# EAGLE design InkTime (EAGLE 9.7.0)

## Sheet 1 of 2
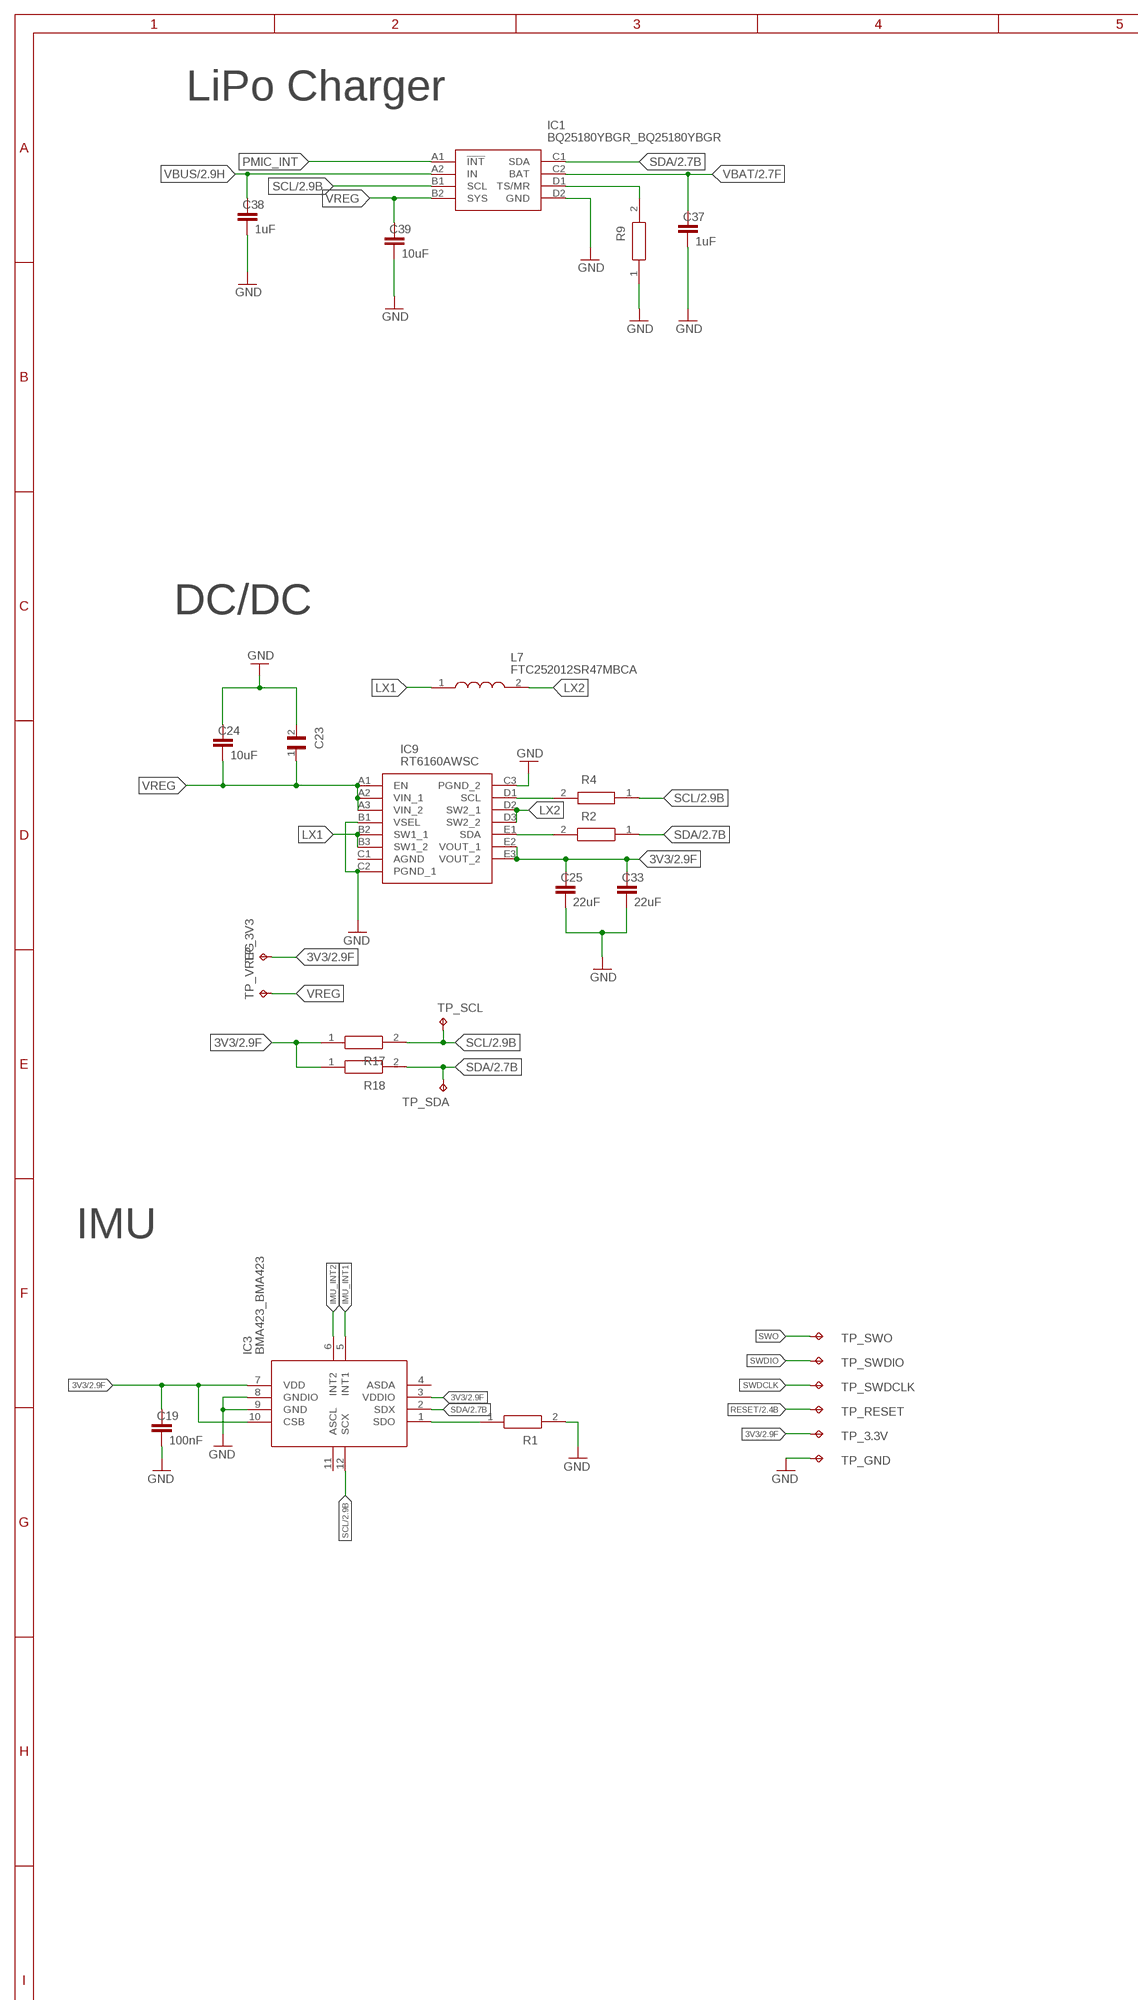
[diagram p0: schematic, sheet 1, part 1 of 2]
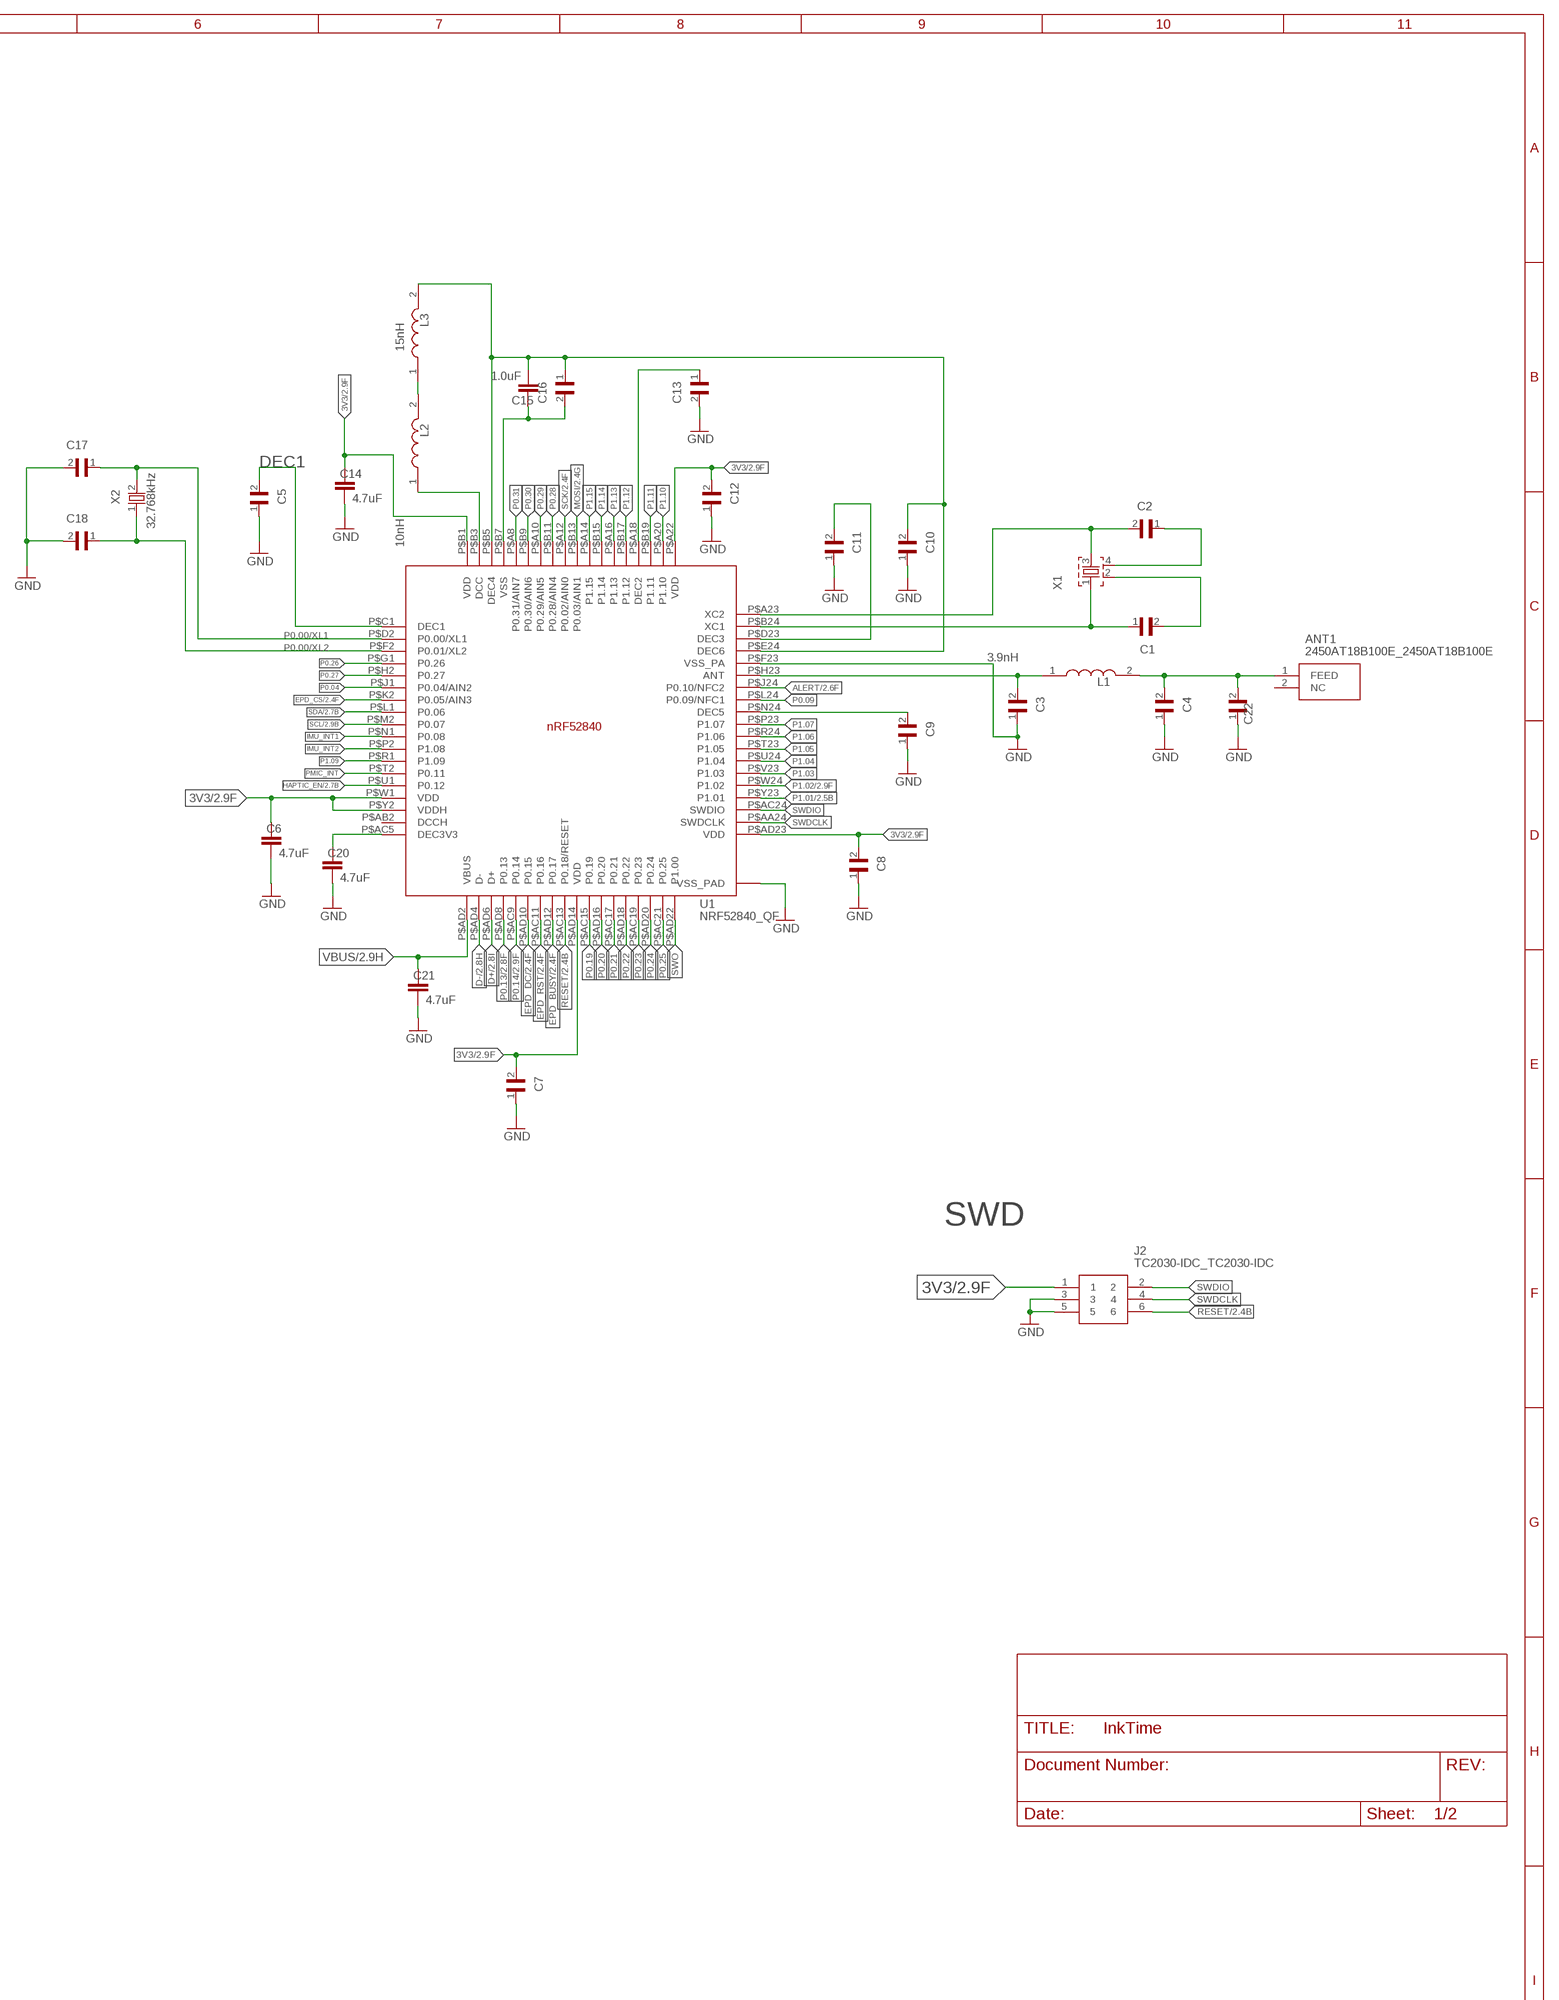
[diagram p1: schematic, sheet 1, part 2 of 2]

### Parts
ANT1  2450AT18B100E_2450AT18B100E  [2450AT18B100E_ANTC3216X140N]
C1  12pF  GRM011R60J152KE01L_2_GRM011R60J152KE01L  [GRM011R60J152KE01L_2_CAPC0201X13N]
C2  12pF  GRM011R60J152KE01L_2_GRM011R60J152KE01L  [GRM011R60J152KE01L_2_CAPC0201X13N]
C3  1pF  GRM011R60J152KE01L_2_GRM011R60J152KE01L  [GRM011R60J152KE01L_2_CAPC0201X13N]
C4  1pF  GRM011R60J152KE01L_2_GRM011R60J152KE01L  [GRM011R60J152KE01L_2_CAPC0201X13N]
C5  100nF  GRM011R60J152KE01L_2_GRM011R60J152KE01L  [GRM011R60J152KE01L_2_CAPC0201X13N]
C6  4.7uF  NORDIC_NRF_3_CAPACITOR_0402_N  [NORDIC_NRF_3_RESC0402_N]
C7  100nF  GRM011R60J152KE01L_2_GRM011R60J152KE01L  [GRM011R60J152KE01L_2_CAPC0201X13N]
C8  100nF  GRM011R60J152KE01L_2_GRM011R60J152KE01L  [GRM011R60J152KE01L_2_CAPC0201X13N]
C9  820pF  GRM011R60J152KE01L_2_GRM011R60J152KE01L  [GRM011R60J152KE01L_2_CAPC0201X13N]
C10  N.C.  GRM011R60J152KE01L_2_GRM011R60J152KE01L  [GRM011R60J152KE01L_2_CAPC0201X13N]
C11  100pF  GRM011R60J152KE01L_2_GRM011R60J152KE01L  [GRM011R60J152KE01L_2_CAPC0201X13N]
C12  100nF  GRM011R60J152KE01L_2_GRM011R60J152KE01L  [GRM011R60J152KE01L_2_CAPC0201X13N]
C13  N.C.  GRM011R60J152KE01L_2_GRM011R60J152KE01L  [GRM011R60J152KE01L_2_CAPC0201X13N]
C14  4.7uF  NORDIC_NRF_3_CAPACITOR_0402_N  [NORDIC_NRF_3_RESC0402_N]
C15  1.0uF  NORDIC_NRF_3_CAPACITOR_0402_N  [NORDIC_NRF_3_RESC0402_N]
C16  47nF  GRM011R60J152KE01L_2_GRM011R60J152KE01L  [GRM011R60J152KE01L_2_CAPC0201X13N]
C17  12pF  GRM011R60J152KE01L_2_GRM011R60J152KE01L  [GRM011R60J152KE01L_2_CAPC0201X13N]
C18  12pF  GRM011R60J152KE01L_2_GRM011R60J152KE01L  [GRM011R60J152KE01L_2_CAPC0201X13N]
C19  100nF  NORDIC_NRF_3_CAPACITOR_0402_N  [NORDIC_NRF_3_RESC0402_N]
C20  4.7uF  NORDIC_NRF_3_CAPACITOR_0402_N  [NORDIC_NRF_3_RESC0402_N]
C21  4.7uF  NORDIC_NRF_3_CAPACITOR_0402_N  [NORDIC_NRF_3_RESC0402_N]
C22  N.C.  GRM011R60J152KE01L_2_GRM011R60J152KE01L  [GRM011R60J152KE01L_2_CAPC0201X13N]
C23  0.1uF  GRM011R60J152KE01L_2_GRM011R60J152KE01L  [GRM011R60J152KE01L_2_CAPC0201X13N]
C24  10uF  NORDIC_NRF_3_CAPACITOR_0402_N  [NORDIC_NRF_3_RESC0402_N]
C25  22uF  NORDIC_NRF_3_CAPACITOR_0402_N  [NORDIC_NRF_3_RESC0402_N]
C33  22uF  NORDIC_NRF_3_CAPACITOR_0402_N  [NORDIC_NRF_3_RESC0402_N]
C37  1uF  NORDIC_NRF_3_CAPACITOR_0402_N  [NORDIC_NRF_3_RESC0402_N]
C38  1uF  NORDIC_NRF_3_CAPACITOR_0402_N  [NORDIC_NRF_3_RESC0402_N]
C39  10uF  NORDIC_NRF_3_CAPACITOR_0402_N  [NORDIC_NRF_3_RESC0402_N]
IC1  BQ25180YBGR_BQ25180YBGR  [BQ25180YBGR_BGA8C40P2X4_100X155X50]
IC3  BMA423_BMA423  [BMA423_BMA423]
IC9  RT6160AWSC  RT6160AWSC_RT6160AWSC  [RT6160AWSC_BGA15C40P3X5_140X230X60]
J2  TC2030-IDC_TC2030-IDC  [TC2030-IDC_TC2030IDC]
L1  3.9nH  MLP2016SR47MT0S1_FTC252012SR47MBCA  [MLP2016SR47MT0S1_INDC2016X100N]
L2  10nH  MLP2016SR47MT0S1_FTC252012SR47MBCA  [MLP2016SR47MT0S1_INDC2016X100N]
L3  15nH  MLP2016SR47MT0S1_FTC252012SR47MBCA  [MLP2016SR47MT0S1_INDC2016X100N]
L7  FTC252012SR47MBCA  MLP2016SR47MT0S1_FTC252012SR47MBCA  [MLP2016SR47MT0S1_INDC2016X100N]
R1  0  ERA-1AEB3401C_CPF0201D7K68C1  [ERA-1AEB3401C_0201]
R2  0  ERA-1AEB3401C_CPF0201D7K68C1  [ERA-1AEB3401C_0201]
R4  0  ERA-1AEB3401C_CPF0201D7K68C1  [ERA-1AEB3401C_0201]
R9  10k  ERA-1AEB3401C_CPF0201D7K68C1  [ERA-1AEB3401C_0201]
R17  3k3  ERA-1AEB3401C_CPF0201D7K68C1  [ERA-1AEB3401C_0201]
R18  3K3  ERA-1AEB3401C_CPF0201D7K68C1  [ERA-1AEB3401C_0201]
TP_3.3V  HECTOR_WATCH_1_TPTP20R  [HECTOR_WATCH_1_TP20R]
TP_3V3  HECTOR_WATCH_1_TPTP20R  [HECTOR_WATCH_1_TP20R]
TP_GND  HECTOR_WATCH_1_TPTP20R  [HECTOR_WATCH_1_TP20R]
TP_RESET  HECTOR_WATCH_1_TPTP20R  [HECTOR_WATCH_1_TP20R]
TP_SCL  HECTOR_WATCH_1_TPTP20R  [HECTOR_WATCH_1_TP20R]
TP_SDA  HECTOR_WATCH_1_TPTP20R  [HECTOR_WATCH_1_TP20R]
TP_SWDCLK  HECTOR_WATCH_1_TPTP20R  [HECTOR_WATCH_1_TP20R]
TP_SWDIO  HECTOR_WATCH_1_TPTP20R  [HECTOR_WATCH_1_TP20R]
TP_SWO  HECTOR_WATCH_1_TPTP20R  [HECTOR_WATCH_1_TP20R]
TP_VREG  HECTOR_WATCH_1_TPTP20R  [HECTOR_WATCH_1_TP20R]
U1  NRF52840_QF  NORDIC_NRF_4_NRF52840_QF  [NORDIC_NRF_4_AQFN50P700X700X85_HS-74N]
X1  NORDIC_NRF_XTAL_32MHZ  [NORDIC_NRF_BT-XTAL_2016_N]
X2  32.768kHz  NORDIC_NRF_1_XTAL_32KHZ  [NORDIC_NRF_1_XTAL_3215_N]

### Nets
3V3 [Power]: C6.1 C7.2 C8.2 C12.2 C14.1 C19.1 C25.1 C33.1 IC3.3(VDDIO) IC3.7(VDD) IC3.10(CSB) IC9.E2(VOUT_1) IC9.E3(VOUT_2) J2.1 R17.1 R18.1 TP_3.3V.TP TP_3V3.TP U1.P$A22(VDD) U1.P$AD14(VDD) U1.P$AD23(VDD) U1.P$B1(VDD) U1.P$W1(VDD) U1.P$Y2(VDDH) ; also sheet 2
ALERT: U1.P$J24(P0.10/NFC2) ; also sheet 2
D+: U1.P$AD6(D+) ; also sheet 2
D-: U1.P$AD4(D-) ; also sheet 2
DEC1: C5.2 U1.P$C1(DEC1)
EPD_BUSY: U1.P$AD12(P0.17) ; also sheet 2
EPD_CS: U1.P$K2(P0.05/AIN3) ; also sheet 2
EPD_DC: U1.P$AD10(P0.15) ; also sheet 2
EPD_RST: U1.P$AC11(P0.16) ; also sheet 2
GND: C3.1 C4.1 C5.1 C6.2 C7.1 C8.1 C9.1 C10.1 C11.1 C12.1 C13.2 C14.2 C17.2 C18.2 C19.2 C20.2 C21.2 C22.1 C23.2 C24.1 C25.2 C33.2 C37.2 C38.2 C39.2 IC1.D2(GND) IC3.8(GNDIO) IC3.9(GND) IC9.B1(VSEL) IC9.C2(PGND_1) IC9.C3(PGND_2) J2.3 J2.5 R1.2 R9.1 TP_GND.TP U1.P$74(VSS_PAD) U1.P$75(VSS_PAD) U1.P$76(VSS_PAD) U1.P$77(VSS_PAD) U1.P$78(VSS_PAD) U1.P$79(VSS_PAD) U1.P$80(VSS_PAD) U1.P$81(VSS_PAD) U1.P$82(VSS_PAD) U1.P$83(VSS_PAD) U1.P$84(VSS_PAD) U1.P$85(VSS_PAD) U1.P$86(VSS_PAD) U1.P$87(VSS_PAD) U1.P$88(VSS_PAD) U1.P$89(VSS_PAD) U1.P$90(VSS_PAD) U1.P$F23(VSS_PA) ; supply symbol labelled SUPPLY1_GND ; also sheet 2
HAPTIC_EN: U1.P$U1(P0.12) ; also sheet 2
IMU_INT1: IC3.5(INT1) U1.P$N1(P0.08)
IMU_INT2: IC3.6(INT2) U1.P$P2(P1.08)
LX1: IC9.B2(SW1_1) IC9.B3(SW1_2) L7.1
LX2: IC9.D2(SW2_1) IC9.D3(SW2_2) L7.2
MOSI: U1.P$B13(P0.03/AIN1) ; also sheet 2
N$2: C20.1 U1.P$AC5(DEC3V3)
N$3: IC1.D1(TS/MR) R9.2
N$4: C9.2 U1.P$N24(DEC5)
N$5: C3.2 L1.1 U1.P$H23(ANT)
N$6: IC9.D1(SCL) R4.2
N$7: ANT1.1(FEED) C4.2 C22.2 L1.2
N$8: IC9.E1(SDA) R2.2
N$9: C10.2 C15.2 C16.1 L3.2 U1.P$B5(DEC4) U1.P$E24(DEC6)
N$10: IC3.1(SDO) R1.1
N$11: C11.2 U1.P$D23(DEC3)
N$12: C2.2 U1.P$A23(XC2) X1.3
N$13: C2.1 X1.4
N$14: C1.2 X1.2
N$15: C1.1 U1.P$B24(XC1) X1.1
N$16: L2.2 L3.1
N$19: C13.1 U1.P$A18(DEC2)
N$30: C15.1 C16.2 U1.P$B7(VSS)
N$32: L2.1 U1.P$B3(DCC)
P0.00/XL1: C17.1 U1.P$D2(P0.00/XL1) X2.2
P0.00/XL2: C18.1 U1.P$F2(P0.01/XL2) X2.1
P0.04: U1.P$J1(P0.04/AIN2)
P0.09: U1.P$L24(P0.09/NFC1)
P0.13: U1.P$AD8(P0.13) ; also sheet 2
P0.14: U1.P$AC9(P0.14) ; also sheet 2
P0.19: U1.P$AC15(P0.19)
P0.20: U1.P$AD16(P0.20)
P0.21: U1.P$AC17(P0.21)
P0.22: U1.P$AD18(P0.22)
P0.23: U1.P$AC19(P0.23)
P0.24: U1.P$AD20(P0.24)
P0.25: U1.P$AC21(P0.25)
P0.26: U1.P$G1(P0.26)
P0.27: U1.P$H2(P0.27)
P0.28: U1.P$B11(P0.28/AIN4)
P0.29: U1.P$A10(P0.29/AIN5)
P0.30: U1.P$B9(P0.30/AIN6)
P0.31: U1.P$A8(P0.31/AIN7)
P1.01: U1.P$Y23(P1.01) ; also sheet 2
P1.02: U1.P$W24(P1.02) ; also sheet 2
P1.03: U1.P$V23(P1.03)
P1.04: U1.P$U24(P1.04)
P1.05: U1.P$T23(P1.05)
P1.06: U1.P$R24(P1.06)
P1.07: U1.P$P23(P1.07)
P1.09: U1.P$R1(P1.09)
P1.10: U1.P$A20(P1.10)
P1.11: U1.P$B19(P1.11)
P1.12: U1.P$B17(P1.12)
P1.13: U1.P$A16(P1.13)
P1.14: U1.P$B15(P1.14)
P1.15: U1.P$A14(P1.15)
PMIC_INT: IC1.A1(!INT) U1.P$T2(P0.11)
RESET: J2.6 TP_RESET.TP U1.P$AC13(P0.18/RESET) ; also sheet 2
SCK: U1.P$A12(P0.02/AIN0) ; also sheet 2
SCL: IC1.B1(SCL) IC3.12(SCX) R4.1 R17.2 TP_SCL.TP U1.P$M2(P0.07) ; also sheet 2
SDA: IC1.C1(SDA) IC3.2(SDX) R2.1 R18.2 TP_SDA.TP U1.P$L1(P0.06) ; also sheet 2
SWDCLK: J2.4 TP_SWDCLK.TP U1.P$AA24(SWDCLK)
SWDIO: J2.2 TP_SWDIO.TP U1.P$AC24(SWDIO)
SWO: TP_SWO.TP U1.P$AD22(P1.00)
VBAT [Power]: C37.1 IC1.C2(BAT) ; also sheet 2
VBUS: C21.1 C38.1 IC1.A2(IN) U1.P$AD2(VBUS) ; also sheet 2
VREG [Power]: C23.1 C24.2 C39.1 IC1.B2(SYS) IC9.A1(EN) IC9.A2(VIN_1) IC9.A3(VIN_2) TP_VREG.TP
Unconnected: ANT1.2(NC) IC3.4(ASDA) IC3.11(ASCL) IC9.C1(AGND) U1.P$AB2(DCCH)

### Notes on the sheet
- LiPo Charger
- DC/DC
- SWD
- IMU

## Sheet 2 of 2
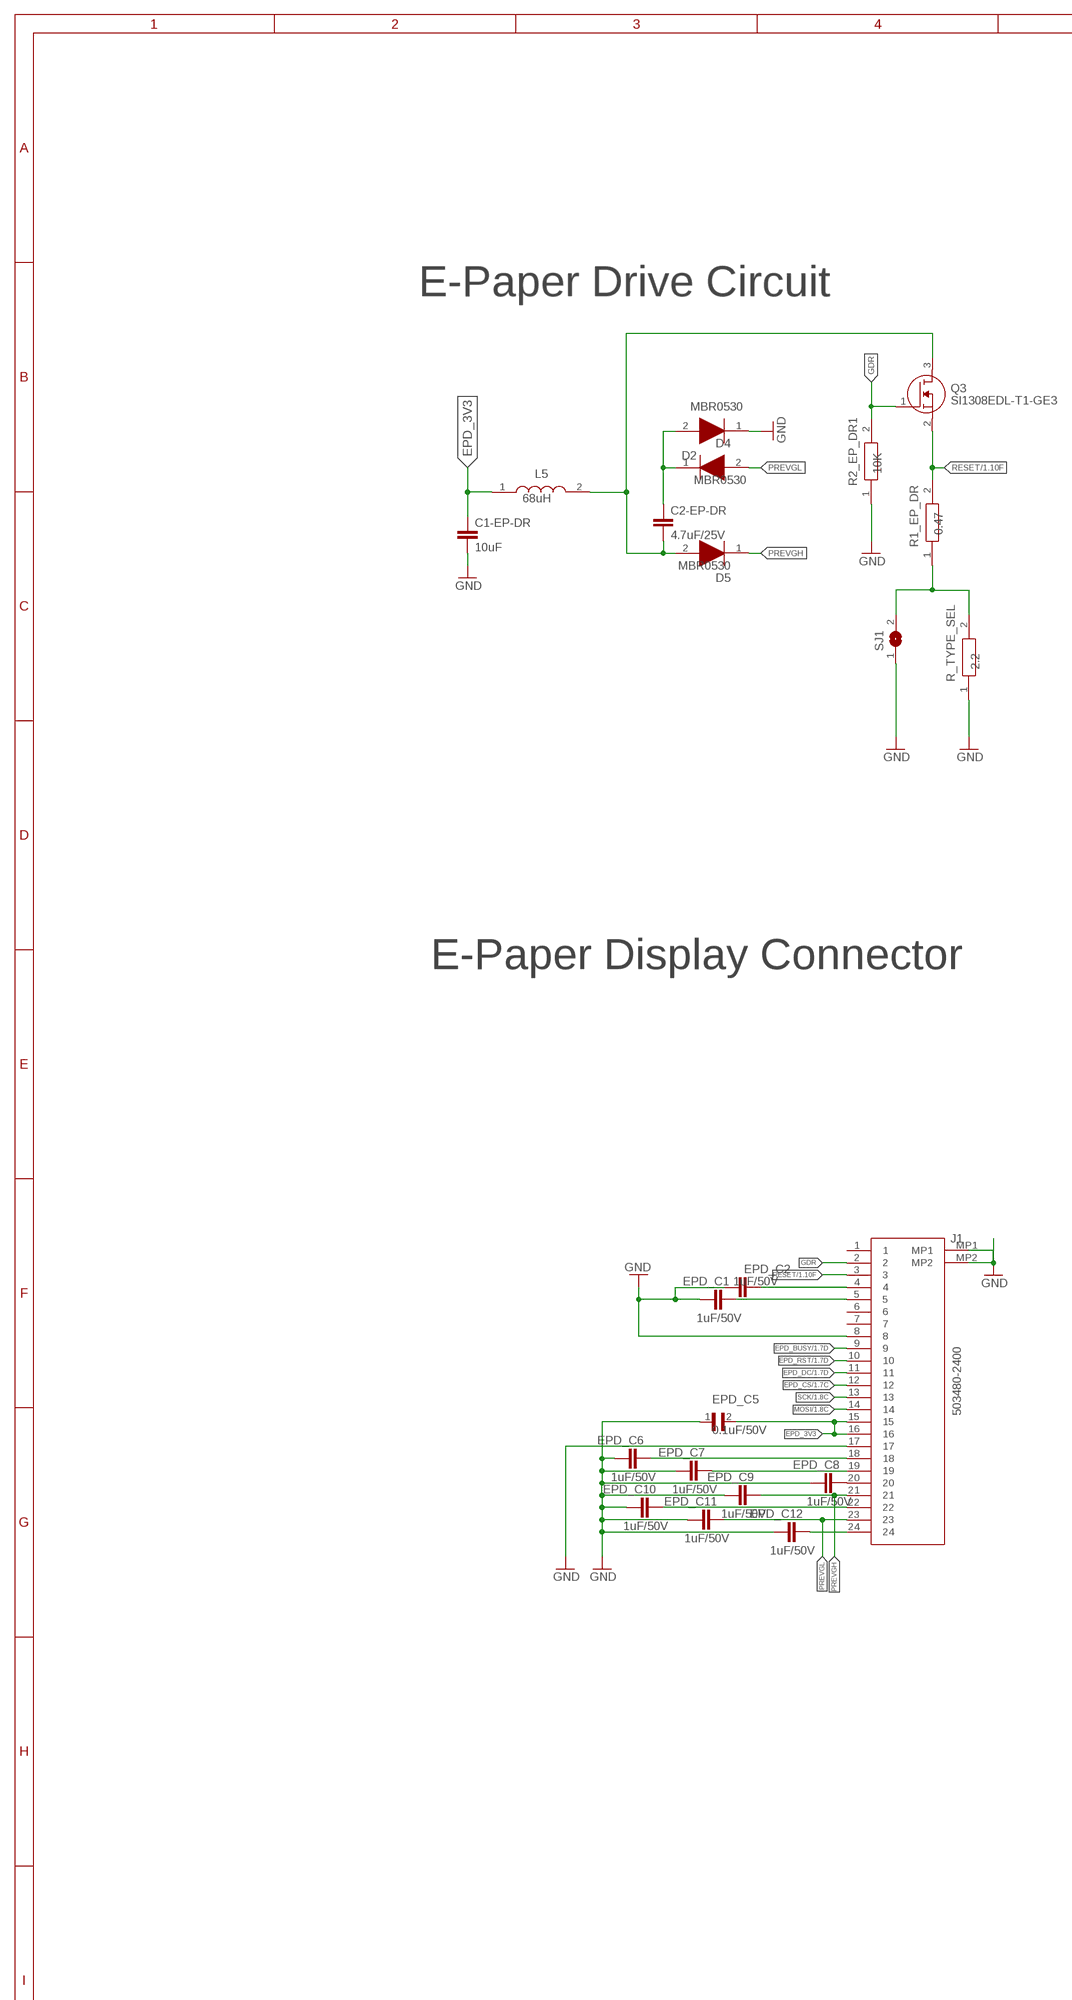
[diagram p2: schematic, sheet 2, part 1 of 2]
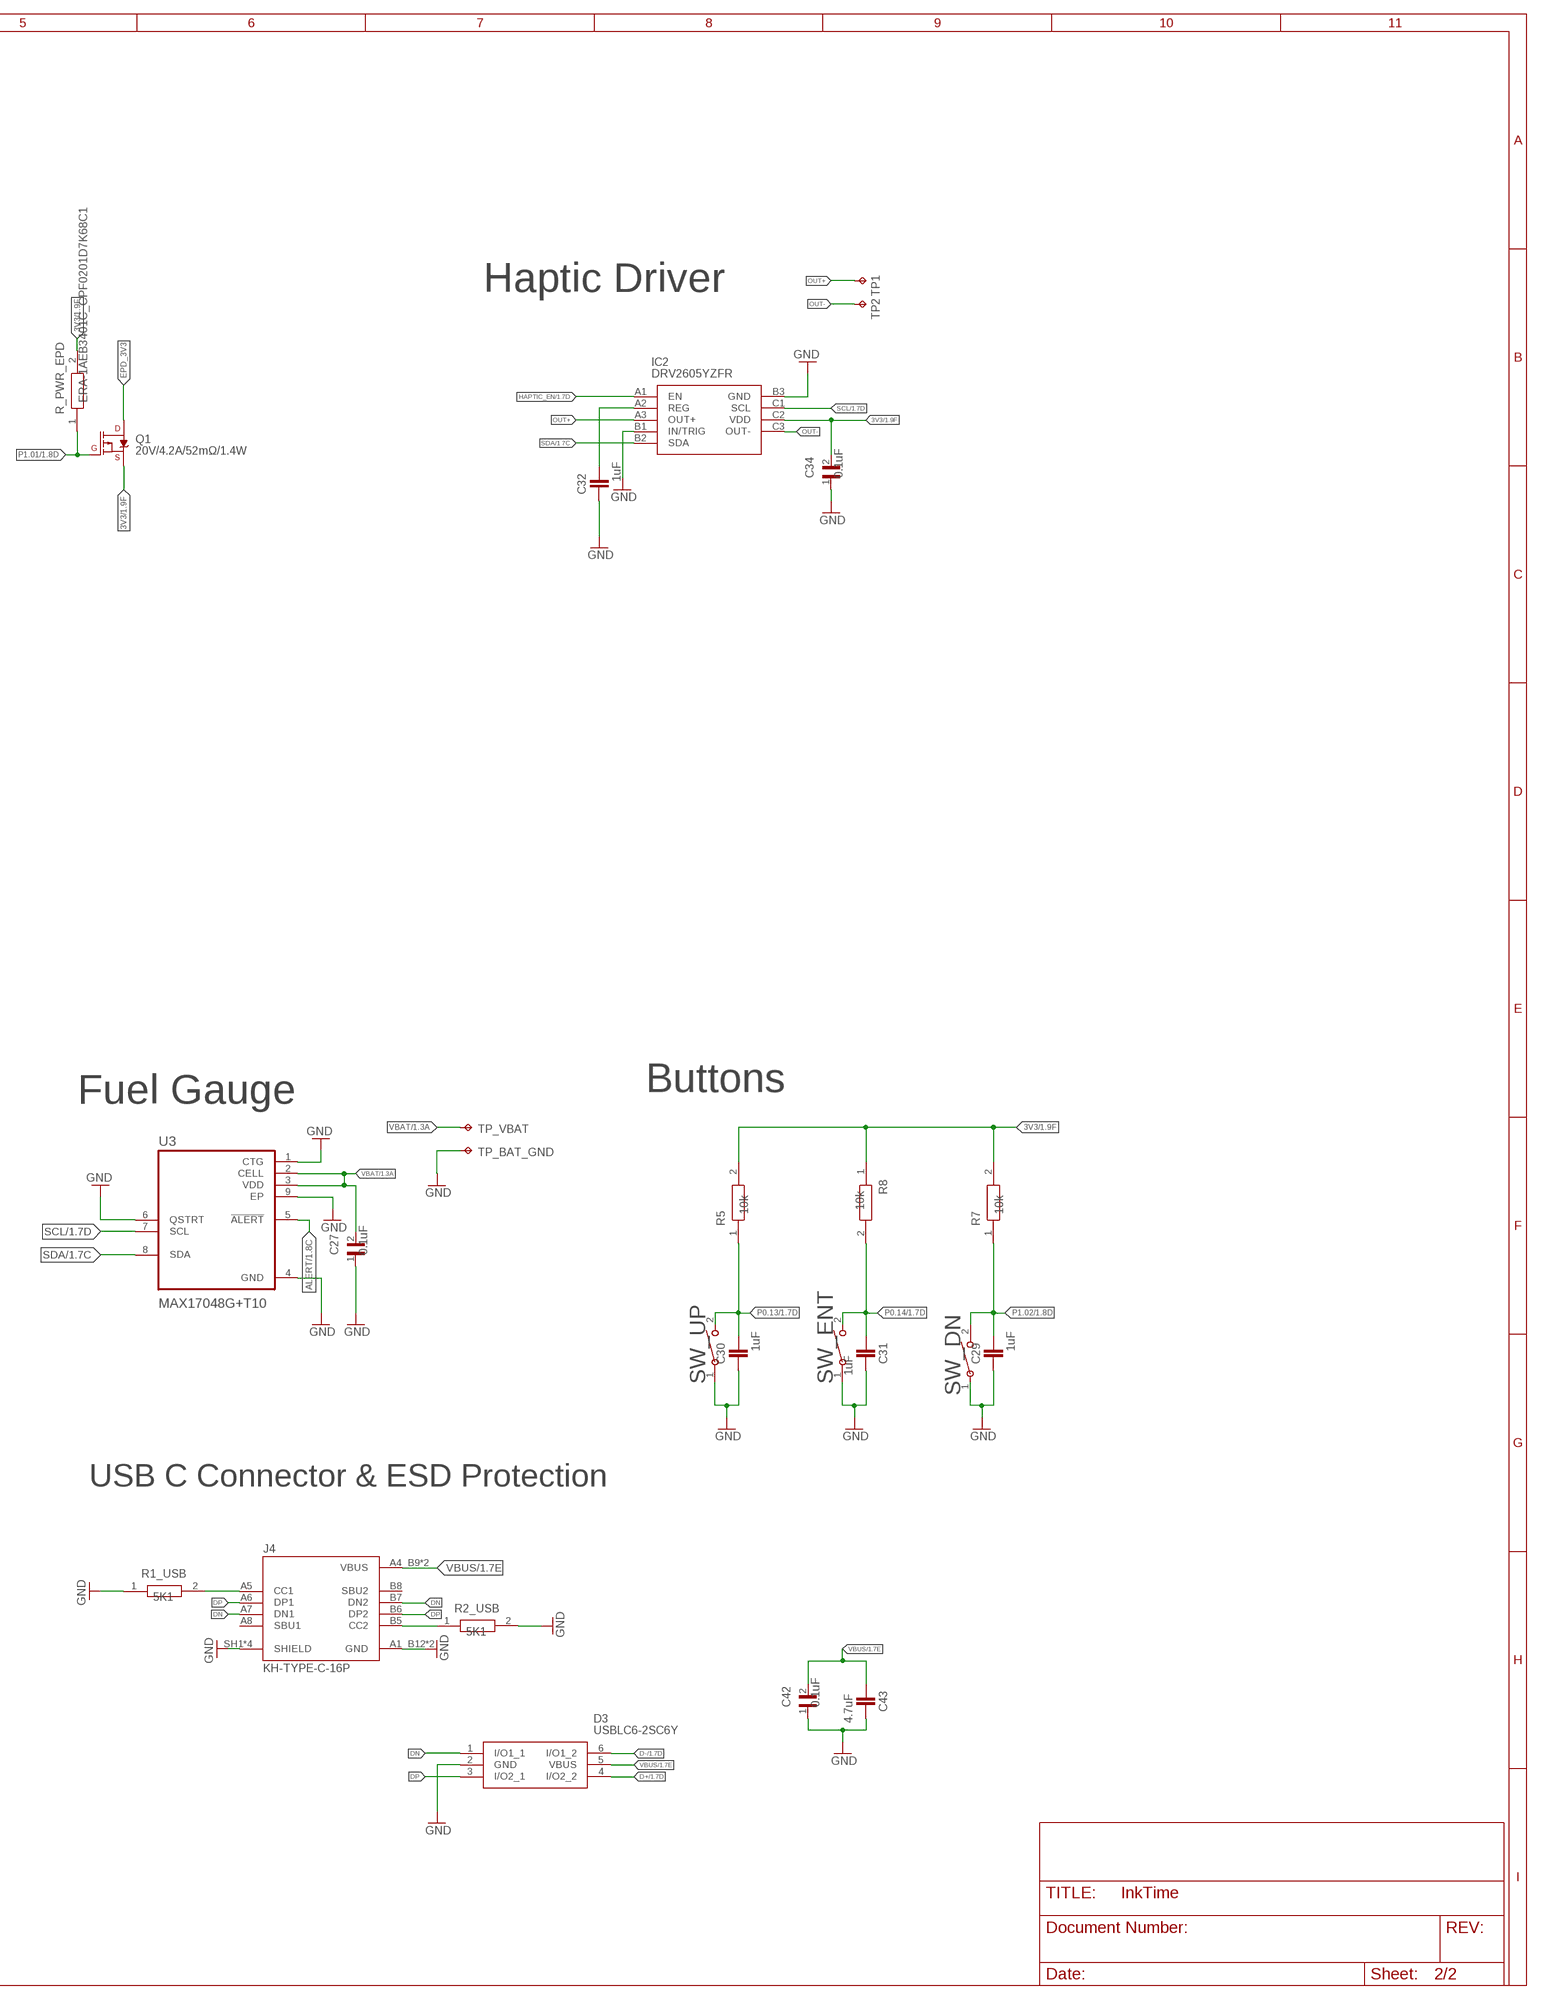
[diagram p3: schematic, sheet 2, part 2 of 2]

### Parts
C1-EP-DR  10uF  NORDIC_NRF_3_CAPACITOR_0402_N  [NORDIC_NRF_3_RESC0402_N]
C2-EP-DR  4.7uF/25V  NORDIC_NRF_3_CAPACITOR_0402_N  [NORDIC_NRF_3_RESC0402_N]
C27  0.1uF  GRM011R60J152KE01L_2_GRM011R60J152KE01L  [GRM011R60J152KE01L_2_CAPC0201X13N]
C29  1uF  NORDIC_NRF_3_CAPACITOR_0402_N  [NORDIC_NRF_3_RESC0402_N]
C30  1uF  NORDIC_NRF_3_CAPACITOR_0402_N  [NORDIC_NRF_3_RESC0402_N]
C31  1uF  NORDIC_NRF_3_CAPACITOR_0402_N  [NORDIC_NRF_3_RESC0402_N]
C32  1uF  NORDIC_NRF_3_CAPACITOR_0402_N  [NORDIC_NRF_3_RESC0402_N]
C34  0.1uF  GRM011R60J152KE01L_2_GRM011R60J152KE01L  [GRM011R60J152KE01L_2_CAPC0201X13N]
C42  0.1uF  GRM011R60J152KE01L_2_GRM011R60J152KE01L  [GRM011R60J152KE01L_2_CAPC0201X13N]
C43  4.7uF  NORDIC_NRF_3_CAPACITOR_0402_N  [NORDIC_NRF_3_RESC0402_N]
D2  MBR0530  ESP32_C6_LIBRARY_5_MBR0530  [ESP32_C6_LIBRARY_5_SOD3716X135N]
D3  USBLC6-2SC6Y  ESP32_C6_LIBRARY_3_USBLC6-2SC6Y  [ESP32_C6_LIBRARY_3_SOT95P280X145-6N]
D4  MBR0530  ESP32_C6_LIBRARY_5_MBR0530  [ESP32_C6_LIBRARY_5_SOD3716X135N]
D5  MBR0530  ESP32_C6_LIBRARY_5_MBR0530  [ESP32_C6_LIBRARY_5_SOD3716X135N]
EPD_C1  1uF/50V  NORDIC_NRF_3_CAPACITOR_0402_N  [NORDIC_NRF_3_RESC0402_N]
EPD_C2  1uF/50V  NORDIC_NRF_3_CAPACITOR_0402_N  [NORDIC_NRF_3_RESC0402_N]
EPD_C5  0.1uF/50V  GRM011R60J152KE01L_2_GRM011R60J152KE01L  [GRM011R60J152KE01L_2_CAPC0201X13N]
EPD_C6  1uF/50V  NORDIC_NRF_3_CAPACITOR_0402_N  [NORDIC_NRF_3_RESC0402_N]
EPD_C7  1uF/50V  NORDIC_NRF_3_CAPACITOR_0402_N  [NORDIC_NRF_3_RESC0402_N]
EPD_C8  1uF/50V  NORDIC_NRF_3_CAPACITOR_0402_N  [NORDIC_NRF_3_RESC0402_N]
EPD_C9  1uF/50V  NORDIC_NRF_3_CAPACITOR_0402_N  [NORDIC_NRF_3_RESC0402_N]
EPD_C10  1uF/50V  NORDIC_NRF_3_CAPACITOR_0402_N  [NORDIC_NRF_3_RESC0402_N]
EPD_C11  1uF/50V  NORDIC_NRF_3_CAPACITOR_0402_N  [NORDIC_NRF_3_RESC0402_N]
EPD_C12  1uF/50V  NORDIC_NRF_3_CAPACITOR_0402_N  [NORDIC_NRF_3_RESC0402_N]
IC2  DRV2605YZFR  DRV2605YZFR_DRV2605YZFR  [DRV2605YZFR_BGA9C50P3X3_144X144X62]
J1  503480-2400  503480-2400_503480-2400  [503480-2400_5034802400]
J4  KH-TYPE-C-16P  KH-TYPE-C-16P_KH-TYPE-C-16P  [KH-TYPE-C-16P_KINGHELM_KH-TYPE-C-16P]
L5  68uH  MLP2016SR47MT0S1_FTC252012SR47MBCA  [MLP2016SR47MT0S1_INDC2016X100N]
Q1  20V/4.2A/52mΩ/1.4W  ESP32_C6_LIBRARY_4_ESP32_WROVER_SPARKFUN-DISCRETESEMI_MOSFET_PCH-DMG2305UX-7  [ESP32_C6_LIBRARY_4_ESP32_C6_LIBRARY_4_ESP32_C6_LIBRARY_4_ESP32_C6_LIBRARY_4_ESP32_WROVER_SPARKFUN-DISCRETESEMI_SOT23-3]
Q3  SI1308EDL-T1-GE3  ESP32_C6_LIBRARY_6_SI1308EDL-T1-GE3  [ESP32_C6_LIBRARY_6_SOT65P210X110-3N]
R1_EP_DR  0.47  ERA-1AEB3401C_CPF0201D7K68C1  [ERA-1AEB3401C_0201]
R1_USB  5K1  ERA-1AEB3401C_CPF0201D7K68C1  [ERA-1AEB3401C_0201]
R2_EP_DR1  10K  ERA-1AEB3401C_CPF0201D7K68C1  [ERA-1AEB3401C_0201]
R2_USB  5K1  ERA-1AEB3401C_CPF0201D7K68C1  [ERA-1AEB3401C_0201]
R5  10k  ERA-1AEB3401C_CPF0201D7K68C1  [ERA-1AEB3401C_0201]
R7  10k  ERA-1AEB3401C_CPF0201D7K68C1  [ERA-1AEB3401C_0201]
R8  10k  ERA-1AEB3401C_CPF0201D7K68C1  [ERA-1AEB3401C_0201]
R_PWR_EPD  ERA-1AEB3401C_CPF0201D7K68C1  [ERA-1AEB3401C_0201]
R_TYPE_SEL  2.2  ERA-1AEB3401C_CPF0201D7K68C1  [ERA-1AEB3401C_0201]
SJ1  ESP32_C6_LIBRARY_7_JUMPER_SJ  [ESP32_C6_LIBRARY_7_JUMPER_SJ]
SW_DN  2025-10-22_07-23-44_LIBRARY_EVP-AKE31ASW_EVP-AKE31A_PAN  [2025-10-22_07-23-44_LIBRARY_SW_EVP-AKE31A_PAN]
SW_ENT  2025-10-22_07-23-44_LIBRARY_EVP-AKE31ASW_EVP-AKE31A_PAN  [2025-10-22_07-23-44_LIBRARY_SW_EVP-AKE31A_PAN]
SW_UP  2025-10-22_07-23-44_LIBRARY_EVP-AKE31ASW_EVP-AKE31A_PAN  [2025-10-22_07-23-44_LIBRARY_SW_EVP-AKE31A_PAN]
TP1  HECTOR_WATCH_1_TPTP20R  [HECTOR_WATCH_1_TP20R]
TP2  HECTOR_WATCH_1_TPTP20R  [HECTOR_WATCH_1_TP20R]
TP_BAT_GND  HECTOR_WATCH_1_TPTP20R  [HECTOR_WATCH_1_TP20R]
TP_VBAT  HECTOR_WATCH_1_TPTP20R  [HECTOR_WATCH_1_TP20R]
U3  MAX17048G+T10  ESP32_C6_LIBRARY_MAX17048G+T10  [ESP32_C6_LIBRARY_SON50P200X200X80-9N]

### Nets
3V3 [Power]: C34.2 IC2.C2(VDD) Q1.2(S) R5.2 R7.2 R8.1 R_PWR_EPD.2 ; also sheet 1
ALERT: U3.5(!ALERT) ; also sheet 1
D+: D3.4(I/O2_2) ; also sheet 1
D-: D3.6(I/O1_2) ; also sheet 1
DN: D3.1(I/O1_1) J4.A7(DN1) J4.B7(DN2)
DP: D3.3(I/O2_1) J4.A6(DP1) J4.B6(DP2)
EPD_3V3 [Power]: C1-EP-DR.1 EPD_C5.2 J1.15 J1.16 L5.1 Q1.3(D)
EPD_BUSY: J1.9 ; also sheet 1
EPD_CS: J1.12 ; also sheet 1
EPD_DC: J1.11 ; also sheet 1
EPD_RST: J1.10 ; also sheet 1
GDR: J1.2 Q3.1(G) R2_EP_DR1.2
GND: C1-EP-DR.2 C27.1 C29.1 C30.1 C31.2 C32.1 C34.1 C42.1 C43.2 D3.2(GND) D4.1(K) EPD_C1.1 EPD_C2.1 EPD_C5.1 EPD_C6.1 EPD_C7.1 EPD_C8.1 EPD_C9.1 EPD_C10.1 EPD_C11.1 EPD_C12.1 IC2.B1(IN/TRIG) IC2.B3(GND) J1.8 J1.17 J1.MP1 J1.MP2 J4.A1_B12(GND) J4.A12_B1(GND) J4.SH1(SHIELD) J4.SH2(SHIELD) J4.SH3(SHIELD) J4.SH4(SHIELD) R1_USB.1 R2_EP_DR1.1 R2_USB.2 R_TYPE_SEL.1 SJ1.1 SW_DN.1 SW_ENT.1 SW_UP.1 TP_BAT_GND.TP U3.1(CTG) U3.4(GND) U3.6(QSTRT) U3.9(EP) ; also sheet 1
HAPTIC_EN: IC2.A1(EN) ; also sheet 1
MOSI: J1.14 ; also sheet 1
N$17: C2-EP-DR.2 D5.2(A) L5.2 Q3.3(D)
N$18: C2-EP-DR.1 D2.1(K) D4.2(A)
N$20: R1_EP_DR.1 R_TYPE_SEL.2 SJ1.2
N$21: J4.A5(CC1) R1_USB.2
N$23: EPD_C2.2 J1.4
N$24: EPD_C1.2 J1.5
N$25: EPD_C6.2 J1.18
N$26: EPD_C7.2 J1.19
N$27: EPD_C8.2 J1.20
N$28: C32.2 IC2.A2(REG)
N$29: EPD_C10.2 J1.22
N$33: EPD_C12.2 J1.24
N$38: J4.B5(CC2) R2_USB.1
OUT+: IC2.A3(OUT+) TP1.TP
OUT-: IC2.C3(OUT-) TP2.TP
P0.13: C30.2 R5.1 SW_UP.2 ; also sheet 1
P0.14: C31.1 R8.2 SW_ENT.2 ; also sheet 1
P1.01: Q1.1(G) R_PWR_EPD.1 ; also sheet 1
P1.02: C29.2 R7.1 SW_DN.2 ; also sheet 1
PREVGH: D5.1(K) EPD_C9.2 J1.21
PREVGL: D2.2(A) EPD_C11.2 J1.23
RESET: J1.3 Q3.2(S) R1_EP_DR.2 ; also sheet 1
SCK: J1.13 ; also sheet 1
SCL: IC2.C1(SCL) U3.7(SCL) ; also sheet 1
SDA: IC2.B2(SDA) U3.8(SDA) ; also sheet 1
VBAT [Power]: C27.2 TP_VBAT.TP U3.2(CELL) U3.3(VDD) ; also sheet 1
VBUS: C42.2 C43.1 D3.5(VBUS) J4.A4_B9(VBUS) J4.A9_B4(VBUS) ; also sheet 1
Unconnected: J1.1 J1.6 J1.7 J4.A8(SBU1) J4.B8(SBU2)

### Notes on the sheet
- E-Paper Drive Circuit | Haptic Driver
- E-Paper Display Connector
- Fuel Gauge | Buttons
- USB C Connector & ESD Protection

## Library data of the parts
ANT1 = InkTime_v5:2450AT18B100E_2450AT18B100E: Antennas 2.45GHz ANTENNA Source: Datasheet <https://www.johansontechnology.com/datasheets/2450AT18B100/2450AT18B100.pdf>; ARROW_PART_NUMBER: 2450AT18B100E; ARROW_PRICE-STOCK: https://www.arrow.com/en/products/2450at18b100e/johanson-dielectrics?utm_currency=USD&region=nac; DESCRIPTION: Antennas 2.45GHz ANTENNA; HEIGHT: 1.4mm; MANUFACTURER_NAME: JOHANSON TECHNOLOGY; MANUFACTURER_PART_NUMBER: 2450AT18B100E; MOUSER_PART_NUMBER: 609-2450AT18B100E; MOUSER_PRICE-STOCK: https://www.mouser.co.uk/ProductDetail/Johanson-Technology/2450AT18B100E?qs=yCnrNFeXz%252Bh5MFsFIXGZGA%3D%3D
C1-C5 C7-C13 C16-C18 C22 C23 C27 C34 C42 EPD_C5 = InkTime_v5:GRM011R60J152KE01L_2_GRM011R60J152KE01L: Check availability <https://pricing.snapeda.com/parts/GRM011R60J152KE01L/Murata/view-part?ref=eda>; AVAILABILITY: In Stock; CHECK_PRICES: https://www.snapeda.com/parts/GRM011R60J152KE01L/Murata/view-part/?ref=eda; DESCRIPTION: SMD Capacitor X5R(EIA) with Capacitance: 1500pF Tol. 10%. Rated Voltage: 6.3Vdc; MF: Murata; MP: GRM011R60J152KE01L; PACKAGE: 0201 Murata; PRICE: None; SNAPEDA_LINK: https://www.snapeda.com/parts/GRM011R60J152KE01L/Murata/view-part/?ref=snap
C1-EP-DR C2-EP-DR C6 C14 C15 C19-C21 C24 C25 C29-C33 C37-C39 C43 EPD_C1 EPD_C2 EPD_C6-EPD_C12 = InkTime_v5:NORDIC_NRF_3_CAPACITOR: Generic chip capacitor
D2 D4 D5 = InkTime_v5:ESP32_C6_LIBRARY_5_MBR0530: ON SEMICONDUCTOR - MBR0530 - DIODE, SCHOTTKY, 0.5A, 30V, SOD-123 Source: Datasheet <http://www.onsemi.com/pub/Collateral/MBR0530T1-D.PDF> Check availability <https://pricing.snapeda.com/parts/MBR0530/ON%20Semiconductor/view-part?ref=eda>; AVAILABILITY: In Stock; CHECK_PRICES: https://www.snapeda.com/parts/MBR0530/Onsemi/view-part/?ref=eda; DESCRIPTION: Diode Schottky 30 V 500mA Surface Mount SOD-123; MF: ON Semiconductor; MP: MBR0530; PACKAGE: SOD-123-2 ON Semiconductor; PRICE: None; PURCHASE-URL: https://www.snapeda.com/api/url_track_click_mouser/?unipart_id=179458&manufacturer=ON Semiconductor&part_name=MBR0530&search_term=None; SNAPEDA_LINK: https://www.snapeda.com/parts/MBR0530/Onsemi/view-part/?ref=snap
D3 = InkTime_v5:ESP32_C6_LIBRARY_3_USBLC6-2SC6Y: Low Cap. ESD Protection Auto SOT-23-6 STMicroelectronics USBLC6-2SC6Y, Dual Uni-Directional TVS Diode Array, 6-Pin SOT-23 Source: Datasheet <https://componentsearchengine.com/Datasheets/1/USBLC6-2SC6Y.pdf> Check availability <https://pricing.snapeda.com/parts/USBLC6-2SC6Y/STMicroelectronics/view-part?ref=eda>; AVAILABILITY: In Stock; CHECK_PRICES: https://www.snapeda.com/parts/USBLC6-2SC6Y/STMicroelectronics/view-part/?ref=eda; DESCRIPTION: 17V Clamp 5A (8/20µs) Ipp Tvs Diode Surface Mount SOT-23-6; MF: STMicroelectronics; MP: USBLC6-2SC6Y; PACKAGE: SOT-23-6 STMicroelectronics; PRICE: None; SNAPEDA_LINK: https://www.snapeda.com/parts/USBLC6-2SC6Y/STMicroelectronics/view-part/?ref=snap
IC1 = InkTime_v5:BQ25180YBGR_BQ25180YBGR: Charger IC Lithium Ion/Polymer, Lithium Iron Phosphate 8-DSBGA (1.6x1.1) Source: Datasheet <https://www.ti.com/lit/ds/symlink/bq25180.pdf?ts=1650264094470&ref_url=https%3A%2F%2Fwww.ti.com%2Fproduct%2FBQ25180>; ARROW_PART_NUMBER: BQ25180YBGR; ARROW_PRICE-STOCK: https://www.arrow.com/en/products/bq25180ybgr/texas-instruments?utm_currency=USD&region=nac; DESCRIPTION: Charger IC Lithium Ion/Polymer, Lithium Iron Phosphate 8-DSBGA (1.6x1.1); HEIGHT: 0.5mm; MANUFACTURER_NAME: Texas Instruments; MANUFACTURER_PART_NUMBER: BQ25180YBGR; MOUSER_PART_NUMBER: 595-BQ25180YBGR; MOUSER_PRICE-STOCK: https://www.mouser.co.uk/ProductDetail/Texas-Instruments/BQ25180YBGR?qs=doiCPypUmgEWjAK%252BJAX6Tw%3D%3D
IC2 = InkTime_v5:DRV2605YZFR_DRV2605YZFR: Haptic Driver for ERM/LRA with Built-In Library and Smart Loop Architecture Source: Datasheet <http://www.ti.com/lit/gpn/drv2605>; ARROW_PART_NUMBER: DRV2605YZFR; ARROW_PRICE-STOCK: https://www.arrow.com/en/products/drv2605yzfr/texas-instruments?region=nac; DESCRIPTION: Haptic Driver for ERM/LRA with Built-In Library and Smart Loop Architecture; HEIGHT: 0.625mm; MANUFACTURER_NAME: Texas Instruments; MANUFACTURER_PART_NUMBER: DRV2605YZFR
IC3 = InkTime_v5:BMA423_BMA423: Accelerometers Triaxial low-g 12bit Acceleration Sensor Source: Datasheet <https://www.mouser.com/datasheet/2/783/BST-BMA423-DS000-1509600.pdf>; ARROW_PART_NUMBER: BMA423; ARROW_PRICE-STOCK: https://www.arrow.com/en/products/bma423/bosch; DESCRIPTION: Accelerometers Triaxial low-g 12bit Acceleration Sensor; HEIGHT: 1mm; MANUFACTURER_NAME: BOSCH; MANUFACTURER_PART_NUMBER: BMA423; MOUSER_PART_NUMBER: 262-BMA423; MOUSER_PRICE-STOCK: https://www.mouser.co.uk/ProductDetail/Bosch-Sensortec/BMA423?qs=HXFqYaX1Q2xC%252BSgeGoX3mg%3D%3D
IC9 = InkTime_v5:RT6160AWSC_RT6160AWSC: Buck-Boost Regulator Positive Output Step-Up/Step-Down I2C DC-DC Controller IC 15-WL-CSP (BSC) (1.4x2.3) Source: Datasheet <https://www.richtek.com/SaveDownload.aspx?specid=RT6160A>; DESCRIPTION: Buck-Boost Regulator Positive Output Step-Up/Step-Down I2C DC-DC Controller IC 15-WL-CSP (BSC) (1.4x2.3); HEIGHT: 0.6mm; MANUFACTURER_NAME: RICHTEK; MANUFACTURER_PART_NUMBER: RT6160AWSC; MOUSER_PART_NUMBER: 835-RT6160AWSC; MOUSER_PRICE-STOCK: https://www.mouser.co.uk/ProductDetail/Richtek/RT6160AWSC?qs=amGC7iS6iy%2FLd9PSoixZXQ%3D%3D
J1 = InkTime_v5:503480-2400_503480-2400: FFC & FPC Connectors 0.5mm FPC RA SMT Dual Contact 24Ckt Source: Datasheet <https://componentsearchengine.com/Datasheets/1/503480-2400.pdf>; DESCRIPTION: FFC & FPC Connectors 0.5mm FPC RA SMT Dual Contact 24Ckt; HEIGHT: 1.87mm; MANUFACTURER_NAME: Molex; MANUFACTURER_PART_NUMBER: 503480-2400; MOUSER_PART_NUMBER: 538-503480-2400; MOUSER_PRICE-STOCK: https://www.mouser.co.uk/ProductDetail/Molex/503480-2400?qs=OAhjpuo3Vu7efIoxFh9AOw%3D%3D
J2 = InkTime_v5:TC2030-IDC_TC2030-IDC: CABLE ADAPTER 6 POS Source: Datasheet <https://datasheet.datasheetarchive.com/originals/distributors/Datasheets_SAMA/62bc384e093448baaaa63dbd0b9d8707.pdf>; DESCRIPTION: CABLE ADAPTER 6 POS; HEIGHT: 19mm; MANUFACTURER_NAME: Tag Connect; MANUFACTURER_PART_NUMBER: TC2030-IDC
J4 = InkTime_v5:KH-TYPE-C-16P_KH-TYPE-C-16P: Check availability <https://pricing.snapeda.com/parts/KH-TYPE-C-16P/kinghelm/view-part?ref=eda>; AVAILABILITY: Not in stock; CHECK_PRICES: https://www.snapeda.com/parts/KH-TYPE-C-16P/Kinghelm/view-part/?ref=eda; MF: kinghelm; MP: KH-TYPE-C-16P; PACKAGE: None; PRICE: None; SNAPEDA_LINK: https://www.snapeda.com/parts/KH-TYPE-C-16P/Kinghelm/view-part/?ref=snap
L1-L3 L5 L7 = InkTime_v5:MLP2016SR47MT0S1_FTC252012SR47MBCA: SMD / SMT Inductors (Coils), L=0.47?H, L x W x T : Source: Datasheet <https://product.tdk.com/system/files/dam/doc/product/inductor/inductor/smd/catalog/inductor_commercial_power_mlp2016_en.pdf>; DESCRIPTION: SMD / SMT Inductors (Coils), L=0.47?H, L x W x T :; HEIGHT: 1mm; JLCPCB: https://jlcpcb.com/partdetail/6763488-FTC252012SR47MBCA/C5832368; MANUFACTURER_NAME: TDK; MANUFACTURER_PART_NUMBER: FTC252012SR47MBCA
Q1 = InkTime_v5:ESP32_C6_LIBRARY_4_ESP32_WROVER_SPARKFUN-DISCRETESEMI_MOSFET_PCH: P-channel MOSFETs Voltage controlled devices that allow control of high current outputs. SparkFun Products: SparkFun ESP32 Thing <https://www.sparkfun.com/products/13907> SparkFun ESP8266 Thing <https://www.sparkfun.com/products/13231> SparkFun Pi Servo HAT V2 <https://www.sparkfun.com/products/15316> DMG2305UX-7 (20V/4.2A/SOT23-3); PROD_ID: TRAN-14388
Q3 = InkTime_v5:ESP32_C6_LIBRARY_6_SI1308EDL-T1-GE3: MOSFET N-Ch 30V 1.5A TrenchFET SC70 Vishay Si1308EDL-T1-GE3 N-channel MOSFET Transistor, 1.5 A, 30 V, 3-Pin SC-70 Source: Datasheet <https://componentsearchengine.com/Datasheets/1/SI1308EDL-T1-GE3.pdf> Check availability <https://pricing.snapeda.com/parts/SI1308EDL-T1-GE3/Vishay%20Siliconix/view-part?ref=eda>; AVAILABILITY: In Stock; CHECK_PRICES: https://www.snapeda.com/parts/SI1308EDL-T1-GE3/Vishay+Siliconix/view-part/?ref=eda; DESCRIPTION: Si1308EDL-T1-GE3 N-channel MOSFET Transistor, 1.5 A, 30 V, 3-Pin SC-70 | Siliconix / Vishay SI1308EDL-T1-GE3; MF: Vishay Siliconix; MP: SI1308EDL-T1-GE3; PACKAGE: SOT-323 Vishay Semiconductor; PRICE: None; PURCHASE-URL: https://www.snapeda.com/api/url_track_click_mouser/?unipart_id=274603&manufacturer=Vishay Siliconix&part_name=SI1308EDL-T1-GE3&search_term=None; SNAPEDA_LINK: https://www.snapeda.com/parts/SI1308EDL-T1-GE3/Vishay+Siliconix/view-part/?ref=snap
R1 R1_EP_DR R1_USB R2 R2_EP_DR1 R2_USB R4 R5 R7-R9 R17 R18 R_PWR_EPD R_TYPE_SEL = InkTime_v5:ERA-1AEB3401C_CPF0201D7K68C1: 7.68k 0201 Thin Film Surface Mount Fixed Resistor +/-0.5% 0.031W CPF0201D7K68C1 Source: Datasheet <http://www.te.com/commerce/DocumentDelivery/DDEController?Action=showdoc&DocId=Data Sheet1773200-1ApdfEnglishENG_DS_1773200-1_A.pdf4-2176215-6>
SJ1 = InkTime_v5:ESP32_C6_LIBRARY_7_JUMPER_SJ: SMD solder JUMPER
SW_DN SW_ENT SW_UP = InkTime_v5:2025-10-22_07-23-44_LIBRARY_EVP-AKE31A; COPYRIGHT: Copyright (C) 2025 Ultra Librarian. All rights reserved.; DIGI-KEY_PART_NUMBER_1: P123437TR-ND; DIGI-KEY_PART_NUMBER_2: P123437CT-ND; DIGI-KEY_PART_NUMBER_3: P123437DKR-ND; MANUFACTURER_NAME: Panasonic; MANUFACTURER_PART_NUMBER: EVP-AKE31A
TP1 TP2 TP_3.3V TP_3V3 TP_BAT_GND TP_GND TP_RESET TP_SCL TP_SDA TP_SWDCLK TP_SWDIO TP_SWO TP_VBAT TP_VREG = InkTime_v5:HECTOR_WATCH_1_TP: Test pad
U1 = InkTime_v5:NORDIC_NRF_4_NRF52840_QF: nRF52840 Features Advanced Single chip 2.4 GHz multi-protocol SoC 32-bit ARM Cortex-M4F Processor 1.7v to 5.5v operation 1MB flash + 256kB RAM Bluetooth 5 support for long range and high throughput 802.15.4 radio support On-chip NFC PPI –Programmable Peripheral Interconnect Automated power management system with automatic power management of each peripheral Configurable I/O mapping for analog and digital I/O 48 x GPIO 1 x QSPI 4 x Master/Slave SPI 2 x Two-wire interface (I²C) I²S interface 2 x UART 4 x PWM USB 2.0 controller ARM TrustZone CryptoCell-310 Cryptographic and security module AES 128-bit ECB/CCM/AAR hardware accelerator Digital microphone interface (PDM) Quadrature decoder 12-bit ADC Low power comparator On-chip 50Ω balun On-air compatible with nRF52, nRF51 and nRF24 Series Applications Advanced high performance wearables Wearables for secure payments Virtual Reality/Augmented Reality systems Smart Home sensor networks Smart city sensor networks High performance HID controllers Internet of Things (IoT) sensor networks Smart door locks Smart lighting networks Connected white goods
U3 = InkTime_v5:ESP32_C6_LIBRARY_MAX17048G+T10: Check availability <https://pricing.snapeda.com/parts/MAX17048G%2BT10/Analog%20Devices/view-part?ref=eda>; AVAILABILITY: In Stock; CHECK_PRICES: https://www.snapeda.com/parts/MAX17048G+T10/Analog+Devices/view-part/?ref=eda; DESCRIPTION: 3µA 1-Cell/2-Cell Fuel Gauge with ModelGauge; MF: Analog Devices; MP: MAX17048G+T10; PACKAGE: TDFN-8 Maxim; PRICE: None; PURCHASE-URL: https://www.snapeda.com/api/url_track_click_mouser/?unipart_id=329239&manufacturer=Analog Devices&part_name=MAX17048G+T10&search_term=None; SNAPEDA_LINK: https://www.snapeda.com/parts/MAX17048G+T10/Analog+Devices/view-part/?ref=snap
X1 = InkTime_v5:NORDIC_NRF_XTAL_32MHZ
X2 = InkTime_v5:NORDIC_NRF_1_XTAL_32KHZ

## Board
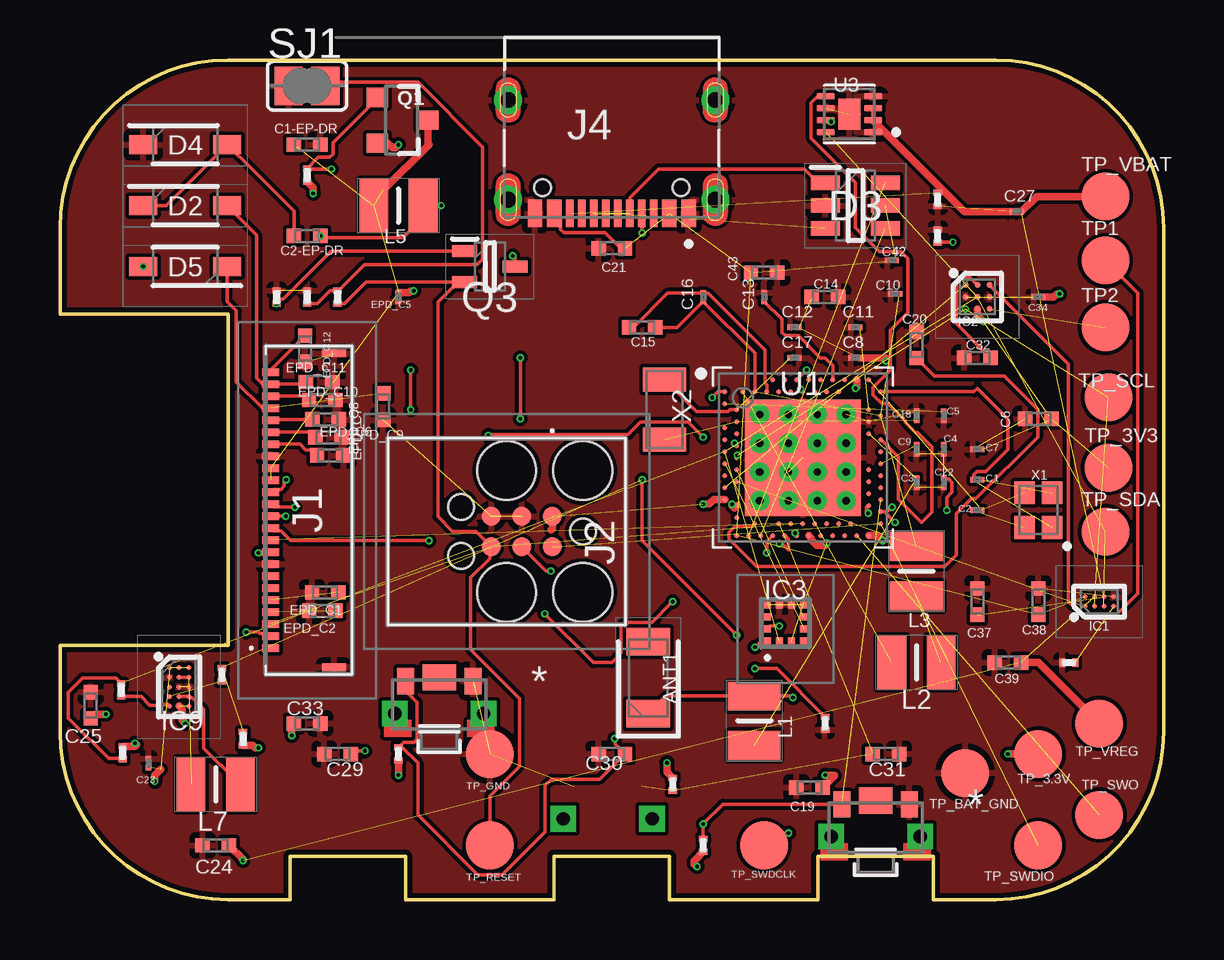
[diagram p4: board, top side]
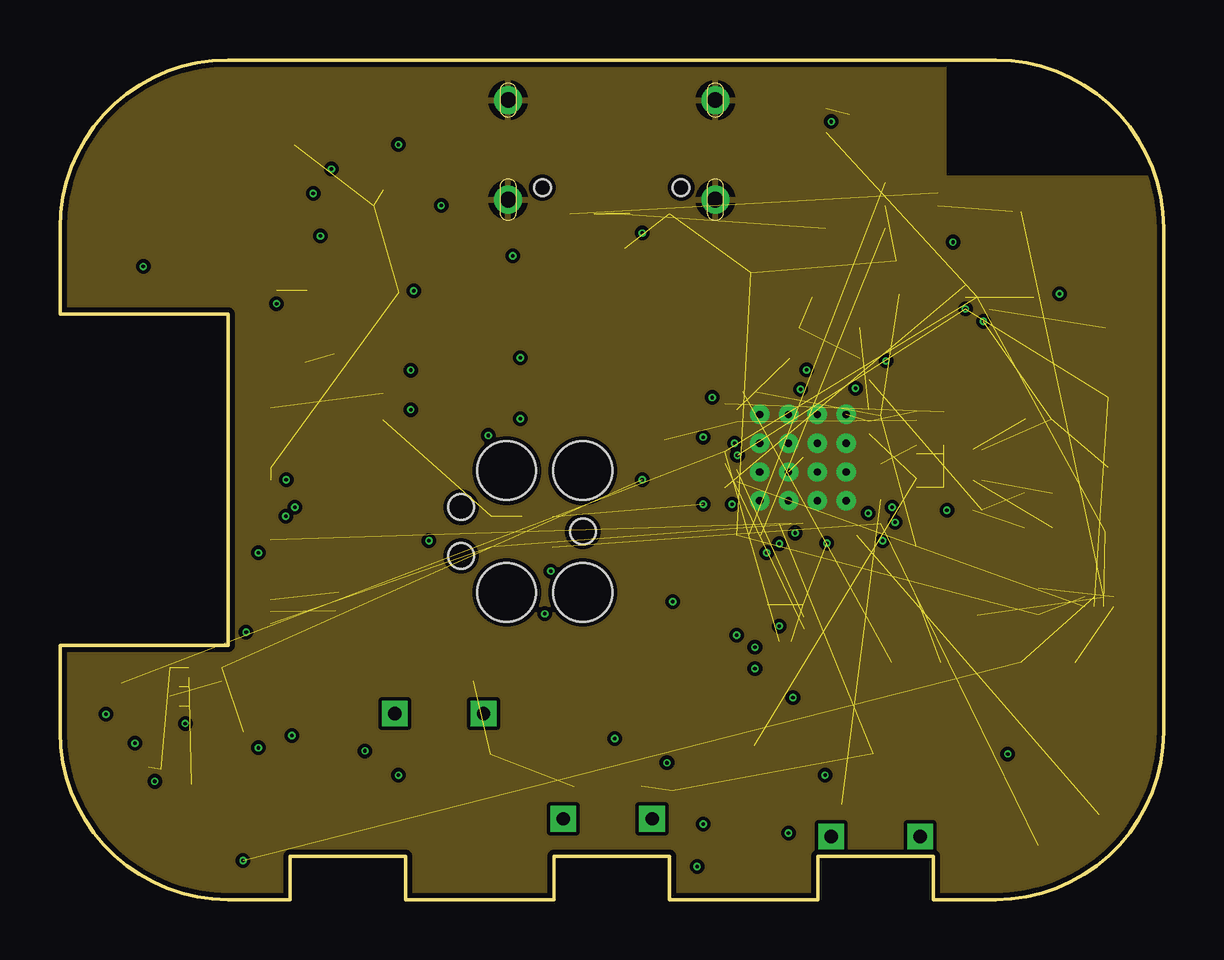
[diagram p5: board, inner layer Route2]
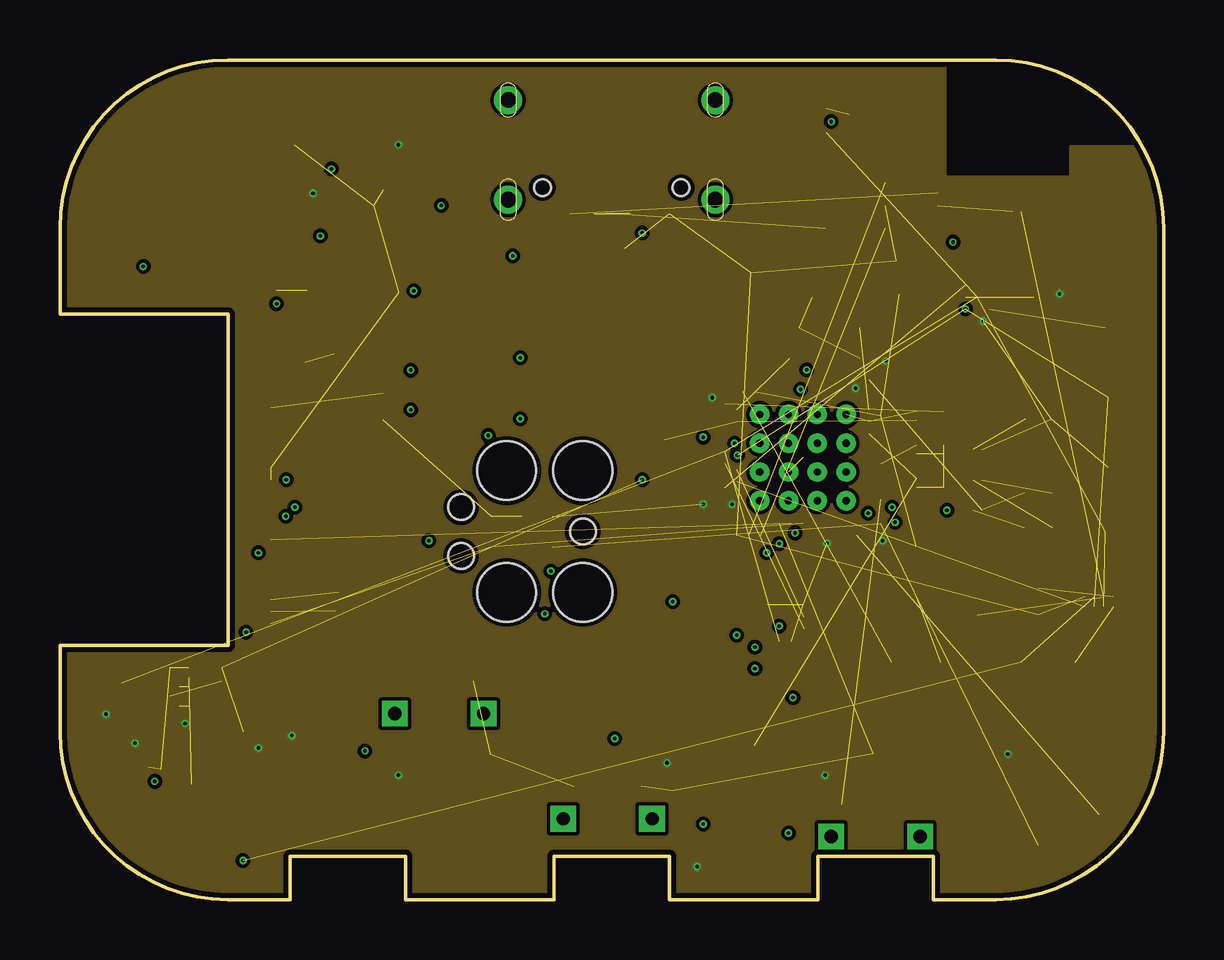
[diagram p6: board, inner layer Route15]
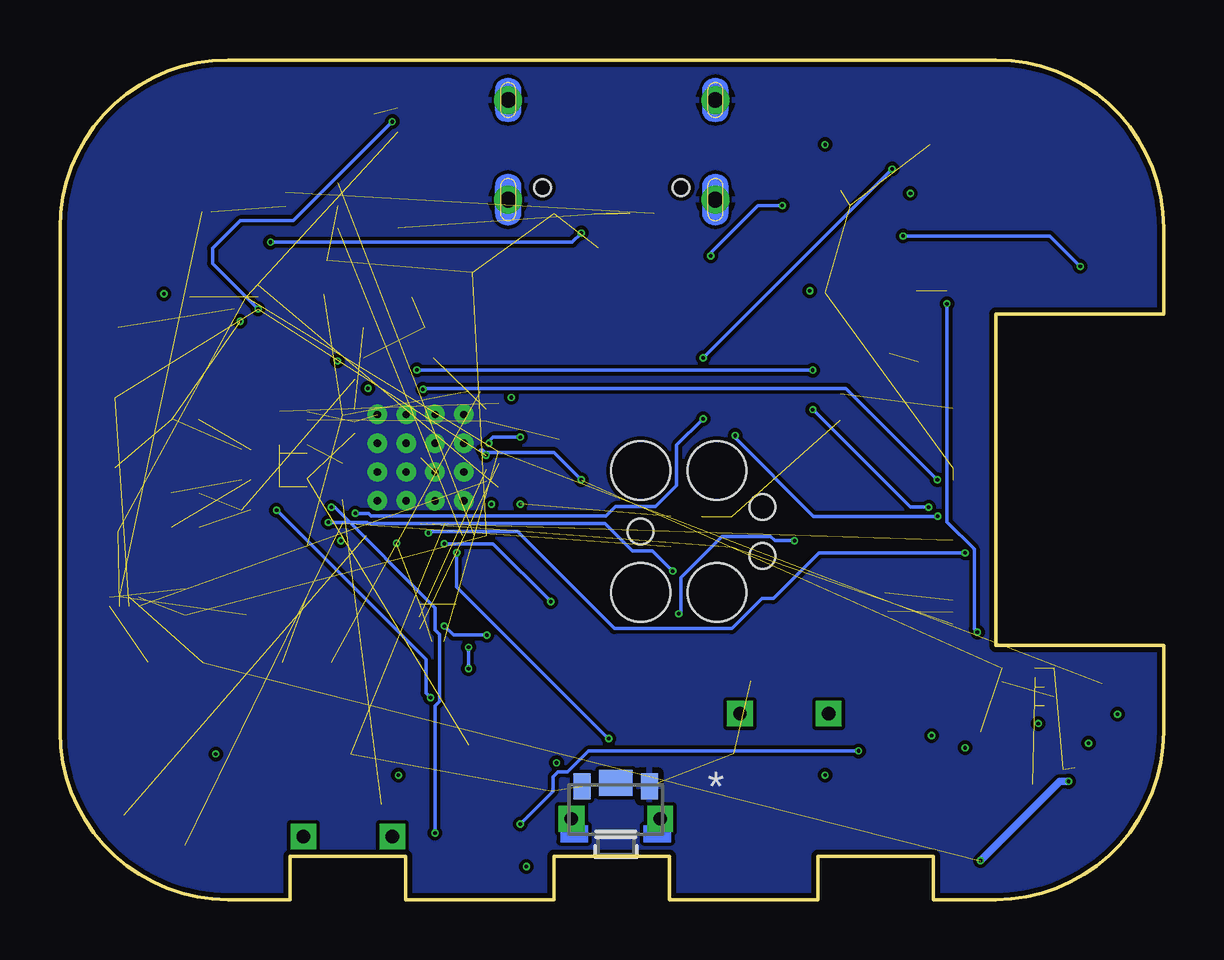
[diagram p7: board, bottom side, seen from below]

Size 46 x 35 mm. Coordinates in mm from the lower left corner, seen from the top.
Outline: 7,35 39,35 arc-90 46,28 46,7 arc-90 39,0 36.4,0 36.4,1.8 31.6,1.8 31.6,0 25.4,0 25.4,1.8 20.6,1.8 20.6,0 14.4,0 14.4,1.8 9.6,1.8 9.6,0 7,0 arc-90 0,7 0,10.6 7,10.6 7,24.4 0,24.4 0,28 arc-90 7,35
Copper layers (1+2*15+16): Top 0.035mm / dielectric 1.5mm / Route2 0.035mm / dielectric 0.15mm / Route15 0.035mm / dielectric 0.2mm / Bottom 0.035mm
Design rules "Fusion Electronics Design Rules *": minimum track width 6mil, minimum drill 0.15mm, track to track 6mil, track to pad 6mil, pad to pad 6mil, via to via 6mil, smd to smd 6mil, copper to edge 0.2mm, drill to drill 6mil, minimum pad ring 10mil, minimum via ring 0.05mm, stop-mask expansion 4mil, vias tented up to drill 9999mil, thermal gap 10mil

### Footprints (pad centres in the part's own frame; a part is rotated, then mirrored left to right if it is on the bottom)
2450AT18B100E_ANTC3216X140N = smd 1.15 x 1.8: 1 -1.5,0; 2 1.5,0
GRM011R60J152KE01L_2_CAPC0201X13N = smd 0.22 x 0.23: 1 -0.185,0; 2 0.185,0
NORDIC_NRF_3_RESC0402_N = smd 0.6 x 0.6: 1 -0.55,0; 2 0.55,0
ESP32_C6_LIBRARY_5_SOD3716X135N = smd 1.15 x 0.8: 1 -1.75,0; 2 1.75,0
ESP32_C6_LIBRARY_3_SOT95P280X145-6N = smd 1.2 x 0.6: 1 -1.25,0.95; 2 -1.25,0; 3 -1.25,-0.95; 4 1.25,-0.95; 5 1.25,0; 6 1.25,0.95
BQ25180YBGR_BGA8C40P2X4_100X155X50 = smd 0.2 x 0.2: A1 -0.2,0.6; A2 0.2,0.6; B1 -0.2,0.2; B2 0.2,0.2; C1 -0.2,-0.2; C2 0.2,-0.2; D1 -0.2,-0.6; D2 0.2,-0.6
DRV2605YZFR_BGA9C50P3X3_144X144X62 = smd 0.25 x 0.25: A1 -0.5,0.5; A2 0,0.5; A3 0.5,0.5; B1 -0.5,0; B2 0,0; B3 0.5,0; C1 -0.5,-0.5; C2 0,-0.5; C3 0.5,-0.5
BMA423_BMA423 = smd 0.3 x 0.35: 1 -0.75,-0.775; 2 -0.25,-0.775; 3 0.25,-0.775; 4 0.75,-0.775; 7 0.75,0.775; 8 0.25,0.775; 9 -0.25,0.775; 10 -0.75,0.775 | smd 0.35 x 0.3: 5 0.775,-0.25; 6 0.775,0.25; 11 -0.775,0.25; 12 -0.775,-0.25
RT6160AWSC_BGA15C40P3X5_140X230X60 = smd 0.216 x 0.216: A1 -0.4,0.8; A2 0,0.8; A3 0.4,0.8; B1 -0.4,0.4; B2 0,0.4; B3 0.4,0.4; C1 -0.4,0; C2 0,0; C3 0.4,0; D1 -0.4,-0.4; D2 0,-0.4; D3 0.4,-0.4; E1 -0.4,-0.8; E2 0,-0.8; E3 0.4,-0.8
503480-2400_5034802400 = smd 0.3 x 0.7: 1 -5.75,1.525; 2 -5.25,1.525; 3 -4.75,1.525; 4 -4.25,1.525; 5 -3.75,1.525; 6 -3.25,1.525; 7 -2.75,1.525; 8 -2.25,1.525; 9 -1.75,1.525; 10 -1.25,1.525; 11 -0.75,1.525; 12 -0.25,1.525; 13 0.25,1.525; 14 0.75,1.525; 15 1.25,1.525; 16 1.75,1.525; 17 2.25,1.525; 18 2.75,1.525; 19 3.25,1.525; 20 3.75,1.525; 21 4.25,1.525; 22 4.75,1.525; 23 5.25,1.525; 24 5.75,1.525 | smd 0.3 x 1: MP1 -6.54,-1.125; MP2 6.54,-1.125
TC2030-IDC_TC2030IDC = smd 0.783 x 0.783: 1 -0.953,-0.635; 2 -0.953,0.635; 3 0.317,-0.635; 4 0.317,0.635; 5 1.588,-0.635; 6 1.588,0.635 | hole 2.451: -2.223,-2.54; -2.223,2.54; 0.952,-2.54; 0.952,2.54 | hole 1.067: -2.223,0; 2.857,-1.016; 2.857,1.016
KH-TYPE-C-16P_KINGHELM_KH-TYPE-C-16P = smd 0.6 x 1.15: A1_B12 -3.2,4.725; A4_B9 -2.4,4.725; A9_B4 2.4,4.725; A12_B1 3.2,4.725 | smd 0.3 x 1.15: A5 -1.25,4.725; A6 -0.25,4.725; A7 0.25,4.725; A8 1.25,4.725; B5 1.75,4.725; B6 0.75,4.725; B7 -0.75,4.725; B8 -1.75,4.725 | drill 0.65 pad 1.05: SH1 -4.32,0; SH2 4.32,0; SH3 -4.32,4.15; SH4 4.32,4.15 | hole 0.7: -2.89,3.65; 2.89,3.65
MLP2016SR47MT0S1_INDC2016X100N = smd 1.2 x 2.2: 1 -1.028,0; 2 1.028,0
ESP32_C6_LIBRARY_4_ESP32_C6_LIBRARY_4_ESP32_C6_LIBRARY_4_ESP32_C6_LIBRARY_4_ESP32_WROVER_SPARKFUN-DISCRETESEMI_SOT23-3 = smd 0.8 x 0.9: 1 -0.95,-1; 2 0.95,-1; 3 0,1.1
ESP32_C6_LIBRARY_6_SOT65P210X110-3N = smd 1.05 x 0.5: 1 -1.05,0.65; 2 -1.05,-0.65; 3 1.05,0
ERA-1AEB3401C_0201 = smd 0.35 x 0.25: 1 0,0.275; 2 0,-0.275
ESP32_C6_LIBRARY_7_JUMPER_SJ = smd 1.168 x 1.6: 1 -0.762,0; 2 0.762,0
2025-10-22_07-23-44_LIBRARY_SW_EVP-AKE31A_PAN = smd 0.711 x 1.092: 1 -1.4,-0.972; 2 1.4,-0.972 | drill 0.559 pad 0.914 square: 3 -1.848,0.381; 4 1.848,0.381 | smd 1.397 x 1.092: 5 0,-1.124
HECTOR_WATCH_1_TP20R = smd 2 x 2: TP 0,0
NORDIC_NRF_4_AQFN50P700X700X85_HS-74N = smd 4.85 x 4.85: P$74 0,0 | drill 0.3 pad 0.6: P$75 -1.8,1.8; P$76 -0.6,1.8; P$77 0.6,1.8; P$78 1.8,1.8; P$79 -1.8,0.6; P$80 -0.6,0.6; P$81 0.6,0.6; P$82 1.8,0.6; P$83 -1.8,-0.6; P$84 -0.6,-0.6; P$85 0.6,-0.6; P$86 1.8,-0.6; P$87 -1.8,-1.8; P$88 -0.6,-1.8; P$89 0.6,-1.8; P$90 1.8,-1.8 | smd 0.2 x 0.2: P$A8 -1.25,3.25; P$A10 -0.75,3.25; P$A12 -0.25,3.25; P$A14 0.25,3.25; P$A16 0.75,3.25; P$A18 1.25,3.25; P$A20 1.75,3.25; P$A22 2.25,3.25; P$A23 2.75,3.25; P$AA24 3.25,-2.25; P$AB2 -2.75,-2.5; P$AC5 -2,-2.75; P$AC9 -1,-2.75; P$AC11 -0.5,-2.75; P$AC13 0,-2.75; P$AC15 0.5,-2.75; P$AC17 1,-2.75; P$AC19 1.5,-2.75; P$AC21 2,-2.75; P$AC24 3.25,-2.75; P$AD2 -2.75,-3.25; P$AD4 -2.25,-3.25; P$AD6 -1.75,-3.25; P$AD8 -1.25,-3.25; P$AD10 -0.75,-3.25; P$AD12 -0.25,-3.25; P$AD14 0.25,-3.25; P$AD16 0.75,-3.25; P$AD18 1.25,-3.25; P$AD20 1.75,-3.25; P$AD22 2.25,-3.25; P$AD23 2.75,-3.25; P$B1 -3.25,2.75; P$B3 -2.5,2.75; P$B5 -2,2.75; P$B7 -1.5,2.75; P$B9 -1,2.75; P$B11 -0.5,2.75; P$B13 0,2.75; P$B15 0.5,2.75; P$B17 1,2.75; P$B19 1.5,2.75; P$B24 3.25,2.75; P$C1 -3.25,2.25; P$D2 -2.75,2; P$D23 2.75,2; P$E24 3.25,1.75; P$F2 -2.75,1.5; P$F23 2.75,1.5; P$G1 -3.25,1.25; P$H2 -2.75,1; P$H23 2.75,1; P$J1 -3.25,0.75; P$J24 3.25,0.75; P$K2 -2.75,0.5; P$L1 -3.25,0.25; P$L24 3.25,0.25; P$M2 -2.75,0; P$N1 -3.25,-0.25; P$N24 3.25,-0.25; P$P2 -2.75,-0.5; P$P23 2.75,-0.5; P$R1 -3.25,-0.75; P$R24 3.25,-0.75; P$T2 -2.75,-1; P$T23 2.75,-1; P$U1 -3.25,-1.25; P$U24 3.25,-1.25; P$V23 2.75,-1.5; P$W1 -3.25,-1.75; P$W24 3.25,-1.75; P$Y2 -2.75,-2; P$Y23 2.75,-2
ESP32_C6_LIBRARY_SON50P200X200X80-9N = smd 0.76 x 0.27: 1 -0.985,0.75; 2 -0.985,0.25; 3 -0.985,-0.25; 4 -0.985,-0.75; 5 0.985,-0.75; 6 0.985,-0.25; 7 0.985,0.25; 8 0.985,0.75 | smd 0.9 x 1.3: 9 0,0
NORDIC_NRF_BT-XTAL_2016_N = smd 0.95 x 0.85: 1 -0.725,-0.575; 2 0.725,-0.575; 3 0.725,0.575; 4 -0.725,0.575
NORDIC_NRF_1_XTAL_3215_N = smd 1 x 1.8: 1 -1.25,0; 2 1.25,0

### Placement (x,y rotation side)
ANT1  24.52,9.24 90 top
C1  38.24,17.5 0 top
C1-EP-DR  10.3,31.47 0 top
C2  38.24,16.23 0 top
C2-EP-DR  10.3,27.66 0 top
C3  35.7,17.37 90 top
C4  36.84,18.77 90 top
C5  36.84,20.17 90 top
C6  40.78,20.04 180 top
C7  38.24,18.77 0 top
C8  33.16,22.58 0 top
C9  35.7,18.77 90 top
C10  34.81,25.25 0 top
C11  33.16,23.85 0 top
C12  30.62,23.85 0 top
C13  29.35,25.12 90 top
C14  31.89,25.12 0 top
C15  24.27,23.85 0 top
C16  26.81,25.12 90 top
C17  30.62,22.58 0 top
C18  35.7,20.17 90 top
C19  31.24,4.67 180 top
C20  35.7,23.12 90 top
C21  23,27.15 180 top
C22  36.84,17.37 90 top
C23  3.7,5.69 90 top
C24  6.49,2.26 0 top
C25  1.28,8.1 90 top
C27  39.89,28.68 0 top
C29  11.57,6.07 0 top
C30  23,6.07 0 top
C31  34.43,6.07 0 top
C32  38.24,22.58 0 top
C33  10.3,7.34 0 top
C34  40.78,25.12 0 top
C37  38.24,12.42 90 top
C38  40.78,12.42 90 top
C39  39.51,9.88 180 top
C42  34.68,26.64 0 top
C43  29.35,26.14 0 top
D2  5.22,28.93 0 top
D3  33.16,28.93 0 top
D4  5.22,31.47 0 top
D5  5.22,26.39 180 top
EPD_C1  11.06,12.8 0 top
EPD_C2  10.94,12.04 0 top
EPD_C5  14.11,25.12 90 top
EPD_C6  11.27,18.52 180 top
EPD_C7  11.19,19.27 180 top
EPD_C8  11.07,20.02 180 top
EPD_C9  13.47,20.55 90 top
EPD_C10  10.94,20.82 180 top
EPD_C11  10.81,21.57 180 top
EPD_C12  10.22,22.96 90 top
IC1  43.32,12.42 90 top
IC2  38.24,25.12 0 top
IC3  30.24,11.53 0 top
IC9  4.97,8.86 0 top
J1  10.3,16.23 90 top
J2  19.57,15.34 180 top
J4  23,33.33 180 top
L1  28.94,7.45 90 top
L2  35.7,9.88 0 top
L3  35.7,13.69 90 top
L5  14.11,28.93 0 top
L7  6.49,4.8 0 top
Q1  14.24,32.49 270 top
Q3  17.92,26.39 0 top
R1  31.89,7.34 0 top
R1_EP_DR  11.57,25.12 0 top
R1_USB  36.59,27.66 0 top
R2  2.55,8.74 0 top
R2_EP_DR1  9.03,25.12 0 top
R2_USB  36.59,29.18 0 top
R4  6.74,9.37 0 top
R5  14.11,6.07 0 top
R7  26.81,2.26 0 top
R8  25.54,4.8 0 top
R9  42.05,9.88 90 top
R17  7.63,6.71 180 top
R18  2.61,6.11 0 top
R_PWR_EPD  10.3,30.2 0 top
R_TYPE_SEL  10.3,25.12 0 top
SJ1  10.3,33.92 0 top
SW_DN  34,3 180 top
SW_ENT  22.83,3.75 180 bottom
SW_UP  15.81,8.14 180 top
TP1  43.57,26.64 0 top
TP2  43.57,23.85 0 top
TP_3.3V  40.78,6.07 0 top
TP_3V3  43.7,18.01 0 top
TP_BAT_GND  37.73,5.28 0 top
TP_GND  17.92,6.07 0 top
TP_RESET  17.92,2.26 0 top
TP_SCL  43.7,20.93 0 top
TP_SDA  43.57,15.34 0 top
TP_SWDCLK  29.35,2.26 0 top
TP_SWDIO  40.78,2.26 0 top
TP_SWO  43.32,3.53 0 top
TP_VBAT  43.57,29.31 0 top
TP_VREG  43.32,7.34 0 top
U1  30.97,18.42 0 top
U3  32.91,32.74 180 top
X1  40.78,16.23 90 top
X2  25.2,20.42 90 top

### Tracks (layer width: path | path; a pad name or v marks a point on that pad's centre or on a via)
3V3  (via drill 0.15 pad 0.3)  (10 unrouted)
  Top 0.152: U1.P$B1 27.43,21.17 v27.19,20.93
  Top 0.305: R18.1 3.13,6.39 3.19,6.45 v3.12,6.51 | IC9.E2 5.09,7.94 5.09,7.47 v5.22,7.34 | C25.1 1.45,7.72 v1.92,7.72 | C19.1 32.27,5.15 32.27,5.18 v31.89,5.18 | R7.2 26.43,1.6 26.43,1.5 v26.56,1.37 | R17.1 8.04,6.43 8.14,6.32 v8.27,6.32 | v14.11,5.18 R5.2 | C33.1 9.66,7.26 v9.66,6.83 | Q1.2 13.66,31.54 13.86,31.34 13.98,31.34 v14.11,31.47 | R_PWR_EPD.2 10.55,29.67 v10.55,29.44 | C34.2 41.41,25.12 41.54,25.25 v41.67,25.25 | IC2.C2 38.24,24.36 v38.49,24.1 | C8.2 34.43,22.58 v34.43,22.45 | U1.P$A22 33.22,21.37 v33.16,21.31 | J2.1 20.52,15.47 20.46,15.4 | U1.P$W1 27.25,16.67 27.06,16.48 v26.81,16.48 | v31.97,14.85 31.88,14.77 31.55,14.77 31.31,15 31.31,15.08 U1.P$AD14 | U1.P$Y2 28.12,16.33 28.02,16.43 v28.02,16.48 | U1.P$AD23 34.08,15.17 v34.3,14.96 | TP_3.3V.TP v39.51,6.07 | v25.3,5.7 25.3,5.31 R8.1
  pour Route15: 42.09,30.14 42.07,30.12 36.95,30.12 36.93,30.14 36.91,30.16 36.89,30.18 36.89,35.2 -0.16,35.2 -0.16,-0.2 42.02,-0.2 45.78,3.56 45.78,31.39 42.13,31.39 42.13,30.18 42.11,30.16
ALERT
  Top 0.152: U3.5 31.6,33.49 31.31,33.2 31.31,31.74 33.16,29.89 33.16,28.01 34.16,27.01 35.05,27.01 35.34,26.73 35.34,24.46 34.61,23.73 34.61,22.06 33.89,21.34 33.89,21.04 34.25,20.67 34.51,20.67 35.25,19.94 35.25,19.89 35.66,19.47 35.73,19.47 36.35,18.86 36.35,16.16 35.91,15.72 34.95,16.68 34.95,18.44 U1.P$J24
D+  (1 unrouted)
D-  (1 unrouted)
DEC1  (1 unrouted)
DN  (1 unrouted)
  Top 0.152: D3.1 31.61,29.88 31.03,30.46 24.95,30.46 23.75,29.26 J4.B7
DP  (2 unrouted)
EPD_3V3  (via drill 0.15 pad 0.3)  (5 unrouted)
  Top 0.305: EPD_C5.2 14.55,25.3 14.62,25.37 v14.74,25.37 | Q1.3 15.34,31.51 15.38,31.47 13.47,29.56
EPD_BUSY  (via drill 0.15 pad 0.3)
  Top 0.152: J1.9 8.3,14.48 v8.27,14.45 | v30.64,15.28 30.64,15.25 U1.P$AD12
  Bottom 0.152: v8.27,14.45 14.36,14.45 16.27,12.55 16.75,12.55 18,11.3 22.89,11.3 26.94,15.34 30.55,15.34 30.61,15.28 v30.64,15.28
EPD_CS  (via drill 0.15 pad 0.3)
  Top 0.152: J1.12 v9.41,15.98 | v17.85,19.34 17.96,19.34 18,19.38 23.69,19.38 24.2,19.9 26.19,19.9 26.33,19.77 26.33,19.76 v26.81,19.28 | v28.12,19.02 U1.P$K2
  Bottom 0.152: v9.41,15.98 14.59,15.98 17.91,19.29 v17.85,19.34 | v26.81,19.28 27.95,19.28 28.12,19.11 v28.12,19.02
EPD_DC  (via drill 0.15 pad 0.3)
  Top 0.152: J1.11 8.9,15.36 9.22,15.36 9.62,14.96 v15.38,14.96 | v20.21,11.91 22.24,9.88 23,9.88 23.39,10.28 23.39,11.41 23.53,11.55 24.67,11.55 v25.54,12.42 | v29.98,14.83 30.11,14.83 30.37,14.58 30.37,15.02 U1.P$AD10
  Bottom 0.152: v15.38,14.96 16.2,14.96 16.38,15.13 18.41,15.13 20.12,13.42 20.12,12 v20.21,11.91 | v25.54,12.42 27.95,14.83 v29.98,14.83
EPD_RST  (1 unrouted)
GDR  (via drill 0.15 pad 0.3)
  Top 0.152: Q3.1 11.3,27.04 9.3,25.04 9.23,25.04 R2_EP_DR1.2 | v7.76,11.15 8.28,11.15 8.33,11.1 8.65,11.1 J1.2
  Bottom 0.152: R2_EP_DR1.2 9.03,15.75 7.89,14.61 7.89,11.28 v7.76,11.15
  other vias: 9.03,24.84
GND  (19 unrouted)
  Top 0.152: 3.73,5.84 C23.2
  pour Route2: 46.16,29.66 45.7,30.12 36.95,30.12 36.93,30.14 36.91,30.16 36.89,30.18 36.89,35.2 -0.29,35.2 -0.29,-0.2 46.16,-0.2
  pour Top: 0.17,-1.47 47.05,-1.47 47.05,35.2 0.17,35.2 -1.05,33.98 -1.05,-0.25
  pour Bottom: -2.32,-1.47 45.83,-1.47 48.32,1.02 48.32,35.25 47.1,36.47 -2.32,36.47
HAPTIC_EN  (1 unrouted)
IMU_INT1  (1 unrouted)
IMU_INT2  (1 unrouted)
LX1  (1 unrouted)
  Top 0.152: IC9.B2 IC9.B3
LX2
  Top 0.152: L7.2 6.72,5.6 6.69,5.6 5.98,6.3 5.98,7.92 5.5,8.4 5.43,8.4 IC9.D3 IC9.D2
MOSI  (via drill 0.15 pad 0.3)
  Top 0.152: J1.14 8.9,17.1 9.22,17.1 9.35,17.23 9.35,17.5 v9.43,17.5 | v30.87,21.27 U1.P$B13
  Bottom 0.152: v9.43,17.5 13.24,21.31 30.83,21.31 v30.87,21.27
N$2
  Top 0.152: C20.1 36.45,21.82 39.37,21.82 40.76,20.43 40.76,19.29 38.19,16.71 37.99,16.71 37.37,16.09 37.37,14.37 36.89,13.89 29.04,13.89 27.89,15.04 27.89,15.31 28.13,15.55 28.84,15.55 U1.P$AC5
N$3  (1 unrouted)
N$4  (1 unrouted)
N$5  (2 unrouted)
N$6  (1 unrouted)
N$7  (via drill 0.15 pad 0.3)  (1 unrouted)
  Top 0.152: ANT1.1 25.26,8.48 L1.2 30.49,8.48 v30.55,8.42 | C22.2 36.87,17.53 37.05,17.53 37.19,17.39 37.19,16.98 36.97,16.77 v36.97,16.23
  Bottom 0.152: v36.97,16.23 30.75,10 30.75,8.61 v30.55,8.42
N$8
  Top 0.152: IC9.E1 4.5,8.13 4.18,8.13 4.16,8.1 3.74,8.1 3.38,8.46 R2.2
N$9  (3 unrouted)
  Top 0.152: C15.2 25.73,23.85 C16.1 28.97,22.78 U1.P$B5
N$10  (via drill 0.15 pad 0.3)
  Top 0.152: R1.1 29.88,9.63 v28.97,9.63 | v28.97,10.52 29.21,10.76 IC3.1
  Bottom 0.152: v28.97,9.63 v28.97,10.52
N$11  (1 unrouted)
N$12  (2 unrouted)
N$13  (1 unrouted)
N$14  (1 unrouted)
N$15  (1 unrouted)
  Top 0.152: U1.P$B24 38.1,21.17 38.24,21.31 39.51,20.04 39.51,18.77 38.58,17.84 38.22,17.84 38.09,17.71 38.09,17.53 C1.1
N$16  (1 unrouted)
N$17  (via drill 0.15 pad 0.3)
  Top 0.152: C2-EP-DR.2 10.91,27.6 14.31,27.6 15.14,28.43 L5.2 v15.89,28.93 | v18.87,26.84 18.97,26.74 Q3.3
  Bottom 0.152: D5.2 4.74,27.66 C2-EP-DR.2 | v15.89,28.93 16.9,28.93 18.94,26.9 v18.87,26.84
  other vias: 3.47,26.39 10.85,27.66
N$18
  Top 0.152: D2.1 4.43,28.93 D4.2 8,30.44 9.75,28.69 C2-EP-DR.1
N$19
  Top 0.152: C13.1 30.1,24.19 30.1,23.64 30.23,23.51 30.78,23.51 31.7,22.58 31.89,22.58 32.22,22.25 U1.P$A18
N$20
  Top 0.152: R_TYPE_SEL.2 10.72,24.84 11.27,25.39 R1_EP_DR.1 11.62,25.39 12.69,26.46 17.39,26.46 17.62,26.7 17.62,31.37 14.93,34.06 11.2,34.06 SJ1.2
N$21  (via drill 0.15 pad 0.3)
  Top 0.152: R1_USB.2 36.61,27.41 v37.22,27.41 | v24.27,27.79 24.25,27.81 J4.A5
  Bottom 0.152: v37.22,27.41 24.65,27.41 v24.27,27.79
N$23  (1 unrouted)
N$24  (1 unrouted)
N$25
  Top 0.152: EPD_C6.2 10.5,18.74 10.24,18.74 10,18.98 J1.18
N$26
  Top 0.152: EPD_C7.2 10.43,19.48 J1.19
N$27
  Top 0.152: EPD_C8.2 8.82,20.02 J1.20
N$28
  Top 0.152: IC2.A2 | IC2.A2 37.89,25.97 37.59,25.97 37.36,25.74 37.36,24.01 C32.2
N$29
  Top 0.152: EPD_C10.2 10.23,20.98 J1.22
N$30
  Top 0.152: C15.1 23.9,23.85 25.32,25.27 26.78,25.27 C16.2 26.84,25.27 27.02,25.27 29.39,22.91 29.39,21.54 29.47,21.46 U1.P$B7
N$32  (1 unrouted)
N$33
  Top 0.152: EPD_C12.2 8.78,22.07 J1.24
N$38  (1 unrouted)
OUT+
  Top 0.152: TP1.TP 44.93,25.29 44.93,12.77 44.06,11.89 42.58,11.89 42.04,12.43 42.04,22.32 IC2.A3 | IC2.A3
OUT-  (1 unrouted)
P0.00/XL1  (1 unrouted)
  Top 0.152: U1.P$D2 27.93,20.42 27.85,20.34 26.52,20.34 X2.2
P0.00/XL2  (2 unrouted)
P0.13  (via drill 0.15 pad 0.3)
  Top 0.152: U1.P$AD8 29.46,14.92 v29.46,14.45 | v23.13,6.71 23.13,6.49 C30.2 22.5,5.02 20.48,5.02 20.22,4.76 20.22,2.82 18.43,1.03 17.41,1.03 14.92,3.52 14.92,5.69 14.27,6.35 R5.1 14.33,6.56 14.76,6.56 14.89,6.7 14.89,8.22 14.41,8.7 SW_UP.2
  Bottom 0.152: v23.13,6.71 29.46,13.04 v29.46,14.45
P0.14  (3 unrouted)
P1.01  (via drill 0.15 pad 0.3)
  Top 0.152: Q1.1 13.24,33.41 11.38,31.55 11.38,31.07 11.24,30.94 10.77,30.94 R_PWR_EPD.1 10.32,30.45 v11.32,30.45 | U1.P$Y23 33.65,16.36 33.62,16.36 33.62,16.18 v33.69,16.1 | v19.19,20.04 v19.19,22.58
  Bottom 0.152: v33.69,16.1 33.14,16.1 33.03,15.99 23.24,15.99 22.85,16.38 21.17,16.38 20.29,17.26 20.29,18.94 v19.19,20.04 | v11.32,30.45 v19.19,22.58
P1.02  (via drill 0.15 pad 0.3)  (1 unrouted)
  Top 0.152: C29.2 12.25,6.2 v12.71,6.2 | R7.1 v26.81,3.15 27.63,3.97 SW_DN.2
  Bottom 0.152: v26.81,3.15 25.44,4.52 25.44,5.12 25.24,5.32 24.85,5.32 23.98,6.2 v12.71,6.2
PMIC_INT  (1 unrouted)
PREVGH  (1 unrouted)
  Top 0.152: D5.1 6.97,24.93 7.35,24.55 7.35,21.58 8.45,20.48 J1.21
PREVGL
  Top 0.152: D2.2 8.2,27.7 8.2,21.73 8.45,21.48 J1.23 10.16,21.48 EPD_C11.2
RESET  (2 unrouted)
  Top 0.152: TP_RESET.TP 17.92,4.33 19.15,5.56 19.15,8.39 17.12,10.43 17.12,13.42 17.92,14.23 17.92,14.64 J2.6 17.35,15.34 16.37,15.34 15.75,15.96 15.75,24.9 16.59,25.74 Q3.2 12.77,25.74 11.87,24.84 R1_EP_DR.2
SCK  (via drill 0.15 pad 0.3)
  Top 0.152: U1.P$A12 31.12,22.07 v31.13,22.07 | v14.62,22.07 v14.62,20.42 | v9.79,16.36 9.22,16.36 8.9,16.36 J1.13
  Bottom 0.152: v31.13,22.07 v14.62,22.07 | v14.62,20.42 10.55,16.36 v9.79,16.36
SCL  (via drill 0.15 pad 0.3)  (5 unrouted)
  Top 0.152: IC3.12 29.59,11.4 29.73,11.4 v29.98,11.4 | v28.21,11.02 24.27,14.96 v24.27,17.5 | v28.24,18.52 28.24,18.45 U1.P$M2 | U3.7 32.05,32.36 32.22,32.36 | 32.23,32.36 32.22,32.36 | 32.22,32.36 v32.15,32.43
  Bottom 0.152: v29.98,11.4 29.6,11.02 v28.21,11.02 | v28.24,18.52 28.46,18.74 28.38,18.74 28.28,18.64 25.41,18.64 v24.27,17.5 | v32.15,32.43 36.29,28.3 38.49,28.3 39.64,27.15 39.64,26.52 IC2.C1
  other vias: 37.74,24.62
SDA  (6 unrouted)
  Top 0.152: R2.1 2.32,9.24 0.95,9.24 0.35,8.64 0.35,7.56 2.02,5.89 2.56,5.89 R18.2
SWDCLK  (via drill 0.15 pad 0.3)
  Top 0.152: TP_SWDCLK.TP 29.86,2.77 v30.37,2.77 | v34.68,16.36 34.5,16.17 U1.P$AA24 34.36,16.17 v34.81,15.72 | v20.46,13.69 20.27,13.69 J2.4
  Bottom 0.152: v34.68,16.36 34.56,16.36 30.36,12.16 30.36,11.25 30.17,11.06 30.17,8.26 30.37,8.07 v30.37,2.77 | v34.81,15.72 33.19,15.72 33.16,15.69 23.28,15.69 22.13,14.53 21.3,14.53 v20.46,13.69
SWDIO  (2 unrouted)
SWO  (1 unrouted)
VBAT  (2 unrouted)
  Top 0.152: U3.3 U3.2
  Top 0.305: TP_VBAT.TP 40.71,29.31 C27.2 37.7,28.68 U3.2
VBUS  (7 unrouted)
  Top 0.152: J4.A9_B4 20.87,28.33 20.87,27.93 21,27.8 22.73,27.8 23.37,27.15 C21.1
VREG  (via drill 0.15 pad 0.3)  (6 unrouted)
  Top 0.305: TP_VREG.TP 40.78,9.88 C39.1 | C24.2 7.63,1.67 v7.63,1.62 | v3.95,4.93 3.95,5.18 4.2,5.44
  Bottom 0.305: v7.63,1.62 4.33,4.93 v3.95,4.93